# EAGLE design DatatrakEPROMEmu (EAGLE 6.6.0)

## Sheet 1 of 4: Target I/O, level translation and power
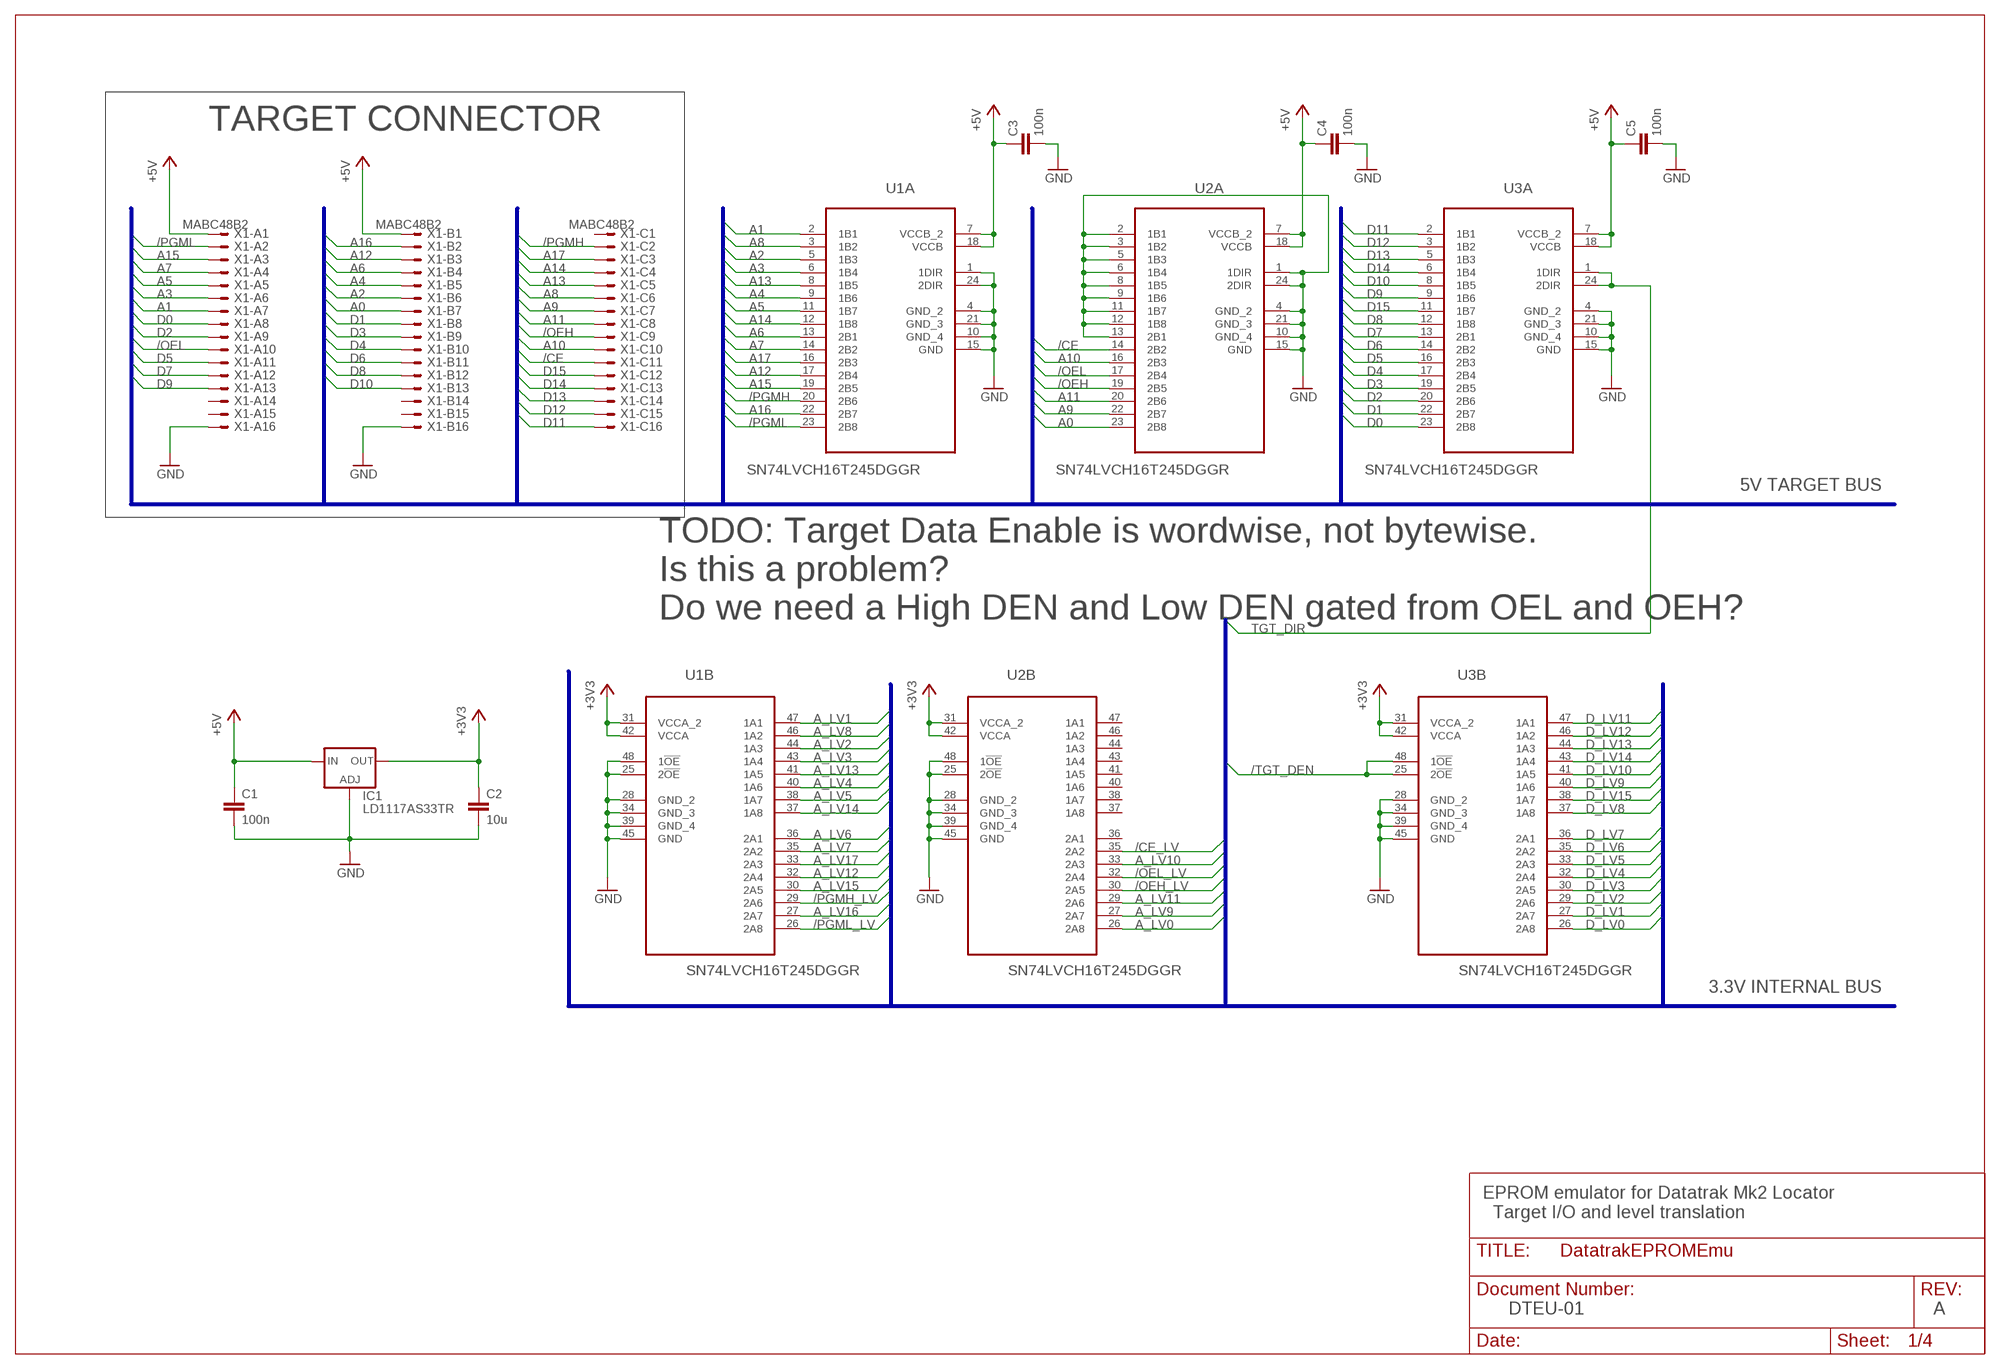
[diagram p0: schematic, sheet 1]

### Parts
C1  100n  C-EUC0805  [C0805]
C2  10u  C-EUC0805  [C0805]
C3  100n  C-EUC0805  [C0805]
C4  100n  C-EUC0805  [C0805]
C5  100n  C-EUC0805  [C0805]
IC1  LD1117AS33TR  LD117AS33TR  [SOT223]
U1  SN74LVCH16T245DGGR  [SOP50P810X120-48N]
U2  SN74LVCH16T245DGGR  [SOP50P810X120-48N]
U3  SN74LVCH16T245DGGR  [SOP50P810X120-48N]
X1  MABC48B2  [MABC48B2]

### Nets
+3V3: C2.1 IC1.4(OUT) U1.31(B:VCCA_2) U1.42(B:VCCA) U2.31(B:VCCA_2) U2.42(B:VCCA) U3.31(B:VCCA_2) U3.42(B:VCCA) ; also sheet 2,3
+5V: C1.1 C3.1 C4.1 C5.1 IC1.3(IN) U1.7(A:VCCB_2) U1.18(A:VCCB) U2.7(A:VCCB_2) U2.18(A:VCCB) U3.7(A:VCCB_2) U3.18(A:VCCB) X1.A1 X1.B1
/CE: U2.14(A:2B2) X1.C11
/CE_LV: U2.35(B:2A2) ; also sheet 3
/OEH: U2.19(A:2B5) X1.C9
/OEH_LV: U2.30(B:2A5) ; also sheet 3
/OEL: U2.17(A:2B4) X1.A10
/OEL_LV: U2.32(B:2A4) ; also sheet 3
/PGMH: U1.20(A:2B6) X1.C2
/PGMH_LV: U1.29(B:2A6) ; also sheet 3
/PGML: U1.23(A:2B8) X1.A2
/PGML_LV: U1.26(B:2A8) ; also sheet 3
/TGT_DEN: U3.25(B:2!OE) U3.48(B:1!OE) ; also sheet 3
A0: U2.23(A:2B8) X1.B7
A1: U1.2(A:1B1) X1.A7
A2: U1.5(A:1B3) X1.B6
A3: U1.6(A:1B4) X1.A6
A4: U1.9(A:1B6) X1.B5
A5: U1.11(A:1B7) X1.A5
A6: U1.13(A:2B1) X1.B4
A7: U1.14(A:2B2) X1.A4
A8: U1.3(A:1B2) X1.C6
A9: U2.22(A:2B7) X1.C7
A10: U2.16(A:2B3) X1.C10
A11: U2.20(A:2B6) X1.C8
A12: U1.17(A:2B4) X1.B3
A13: U1.8(A:1B5) X1.C5
A14: U1.12(A:1B8) X1.C4
A15: U1.19(A:2B5) X1.A3
A16: U1.22(A:2B7) X1.B2
A17: U1.16(A:2B3) X1.C3
A_LV0: U2.26(B:2A8) ; also sheet 3
A_LV1: U1.47(B:1A1) ; also sheet 3
A_LV2: U1.44(B:1A3) ; also sheet 3
A_LV3: U1.43(B:1A4) ; also sheet 3
A_LV4: U1.40(B:1A6) ; also sheet 3
A_LV5: U1.38(B:1A7) ; also sheet 3
A_LV6: U1.36(B:2A1) ; also sheet 3
A_LV7: U1.35(B:2A2) ; also sheet 3
A_LV8: U1.46(B:1A2) ; also sheet 3
A_LV9: U2.27(B:2A7) ; also sheet 3
A_LV10: U2.33(B:2A3) ; also sheet 3
A_LV11: U2.29(B:2A6) ; also sheet 3
A_LV12: U1.32(B:2A4) ; also sheet 3
A_LV13: U1.41(B:1A5) ; also sheet 3
A_LV14: U1.37(B:1A8) ; also sheet 3
A_LV15: U1.30(B:2A5) ; also sheet 3
A_LV16: U1.27(B:2A7) ; also sheet 3
A_LV17: U1.33(B:2A3) ; also sheet 3
D0: U3.23(A:2B8) X1.A8
D1: U3.22(A:2B7) X1.B8
D2: U3.20(A:2B6) X1.A9
D3: U3.19(A:2B5) X1.B9
D4: U3.17(A:2B4) X1.B10
D5: U3.16(A:2B3) X1.A11
D6: U3.14(A:2B2) X1.B11
D7: U3.13(A:2B1) X1.A12
D8: U3.12(A:1B8) X1.B12
D9: U3.9(A:1B6) X1.A13
D10: U3.8(A:1B5) X1.B13
D11: U3.2(A:1B1) X1.C16
D12: U3.3(A:1B2) X1.C15
D13: U3.5(A:1B3) X1.C14
D14: U3.6(A:1B4) X1.C13
D15: U3.11(A:1B7) X1.C12
D_LV0: U3.26(B:2A8) ; also sheet 2,3
D_LV1: U3.27(B:2A7) ; also sheet 2,3
D_LV2: U3.29(B:2A6) ; also sheet 2,3
D_LV3: U3.30(B:2A5) ; also sheet 2,3
D_LV4: U3.32(B:2A4) ; also sheet 2,3
D_LV5: U3.33(B:2A3) ; also sheet 2,3
D_LV6: U3.35(B:2A2) ; also sheet 2,3
D_LV7: U3.36(B:2A1) ; also sheet 2,3
D_LV8: U3.37(B:1A8) ; also sheet 2,3
D_LV9: U3.40(B:1A6) ; also sheet 2,3
D_LV10: U3.41(B:1A5) ; also sheet 2,3
D_LV11: U3.47(B:1A1) ; also sheet 2,3
D_LV12: U3.46(B:1A2) ; also sheet 2,3
D_LV13: U3.44(B:1A3) ; also sheet 2,3
D_LV14: U3.43(B:1A4) ; also sheet 2,3
D_LV15: U3.38(B:1A7) ; also sheet 2,3
GND: C1.2 C2.2 C3.2 C4.2 C5.2 IC1.1(ADJ) U1.1(A:1DIR) U1.4(A:GND_2) U1.10(A:GND_4) U1.15(A:GND) U1.21(A:GND_3) U1.24(A:2DIR) U1.25(B:2!OE) U1.28(B:GND_2) U1.34(B:GND_3) U1.39(B:GND_4) U1.45(B:GND) U1.48(B:1!OE) U2.1(A:1DIR) U2.2(A:1B1) U2.3(A:1B2) U2.4(A:GND_2) U2.5(A:1B3) U2.6(A:1B4) U2.8(A:1B5) U2.9(A:1B6) U2.10(A:GND_4) U2.11(A:1B7) U2.12(A:1B8) U2.13(A:2B1) U2.15(A:GND) U2.21(A:GND_3) U2.24(A:2DIR) U2.25(B:2!OE) U2.28(B:GND_2) U2.34(B:GND_3) U2.39(B:GND_4) U2.45(B:GND) U2.48(B:1!OE) U3.4(A:GND_2) U3.10(A:GND_4) U3.15(A:GND) U3.21(A:GND_3) U3.28(B:GND_2) U3.34(B:GND_3) U3.39(B:GND_4) U3.45(B:GND) X1.A16 X1.B16 ; also sheet 2,3,4
TGT_DIR: U3.1(A:1DIR) U3.24(A:2DIR) ; also sheet 3
Unconnected: U2.36(B:2A1) U2.37(B:1A8) U2.38(B:1A7) U2.40(B:1A6) U2.41(B:1A5) U2.43(B:1A4) U2.44(B:1A3) U2.46(B:1A2) U2.47(B:1A1) X1.A14 X1.A15 X1.B14 X1.B15 X1.C1

### Buses
/PGML,/PGMH,A[0..17],D[0..15],/CE,/OEL,/OEH
/PGML_LV,/PGMH_LV,A_LV[0..17],D_LV[0..15],/CE_LV,/OEL_LV,/OEH_LV,/TGT_DEN,TGT_DIR

### Notes on the sheet
- TARGET CONNECTOR
- 5V TARGET BUS
- TODO: Target Data Enable is wordwise, not bytewise.
  Is this a problem?
  Do we need a High DEN and Low DEN gated from OEL and OEH?
- 3.3V INTERNAL BUS
- EPROM emulator for Datatrak Mk2 Locator
    Target I/O and level translation
- DTEU-01 | A

## Sheet 2 of 4: SRAM
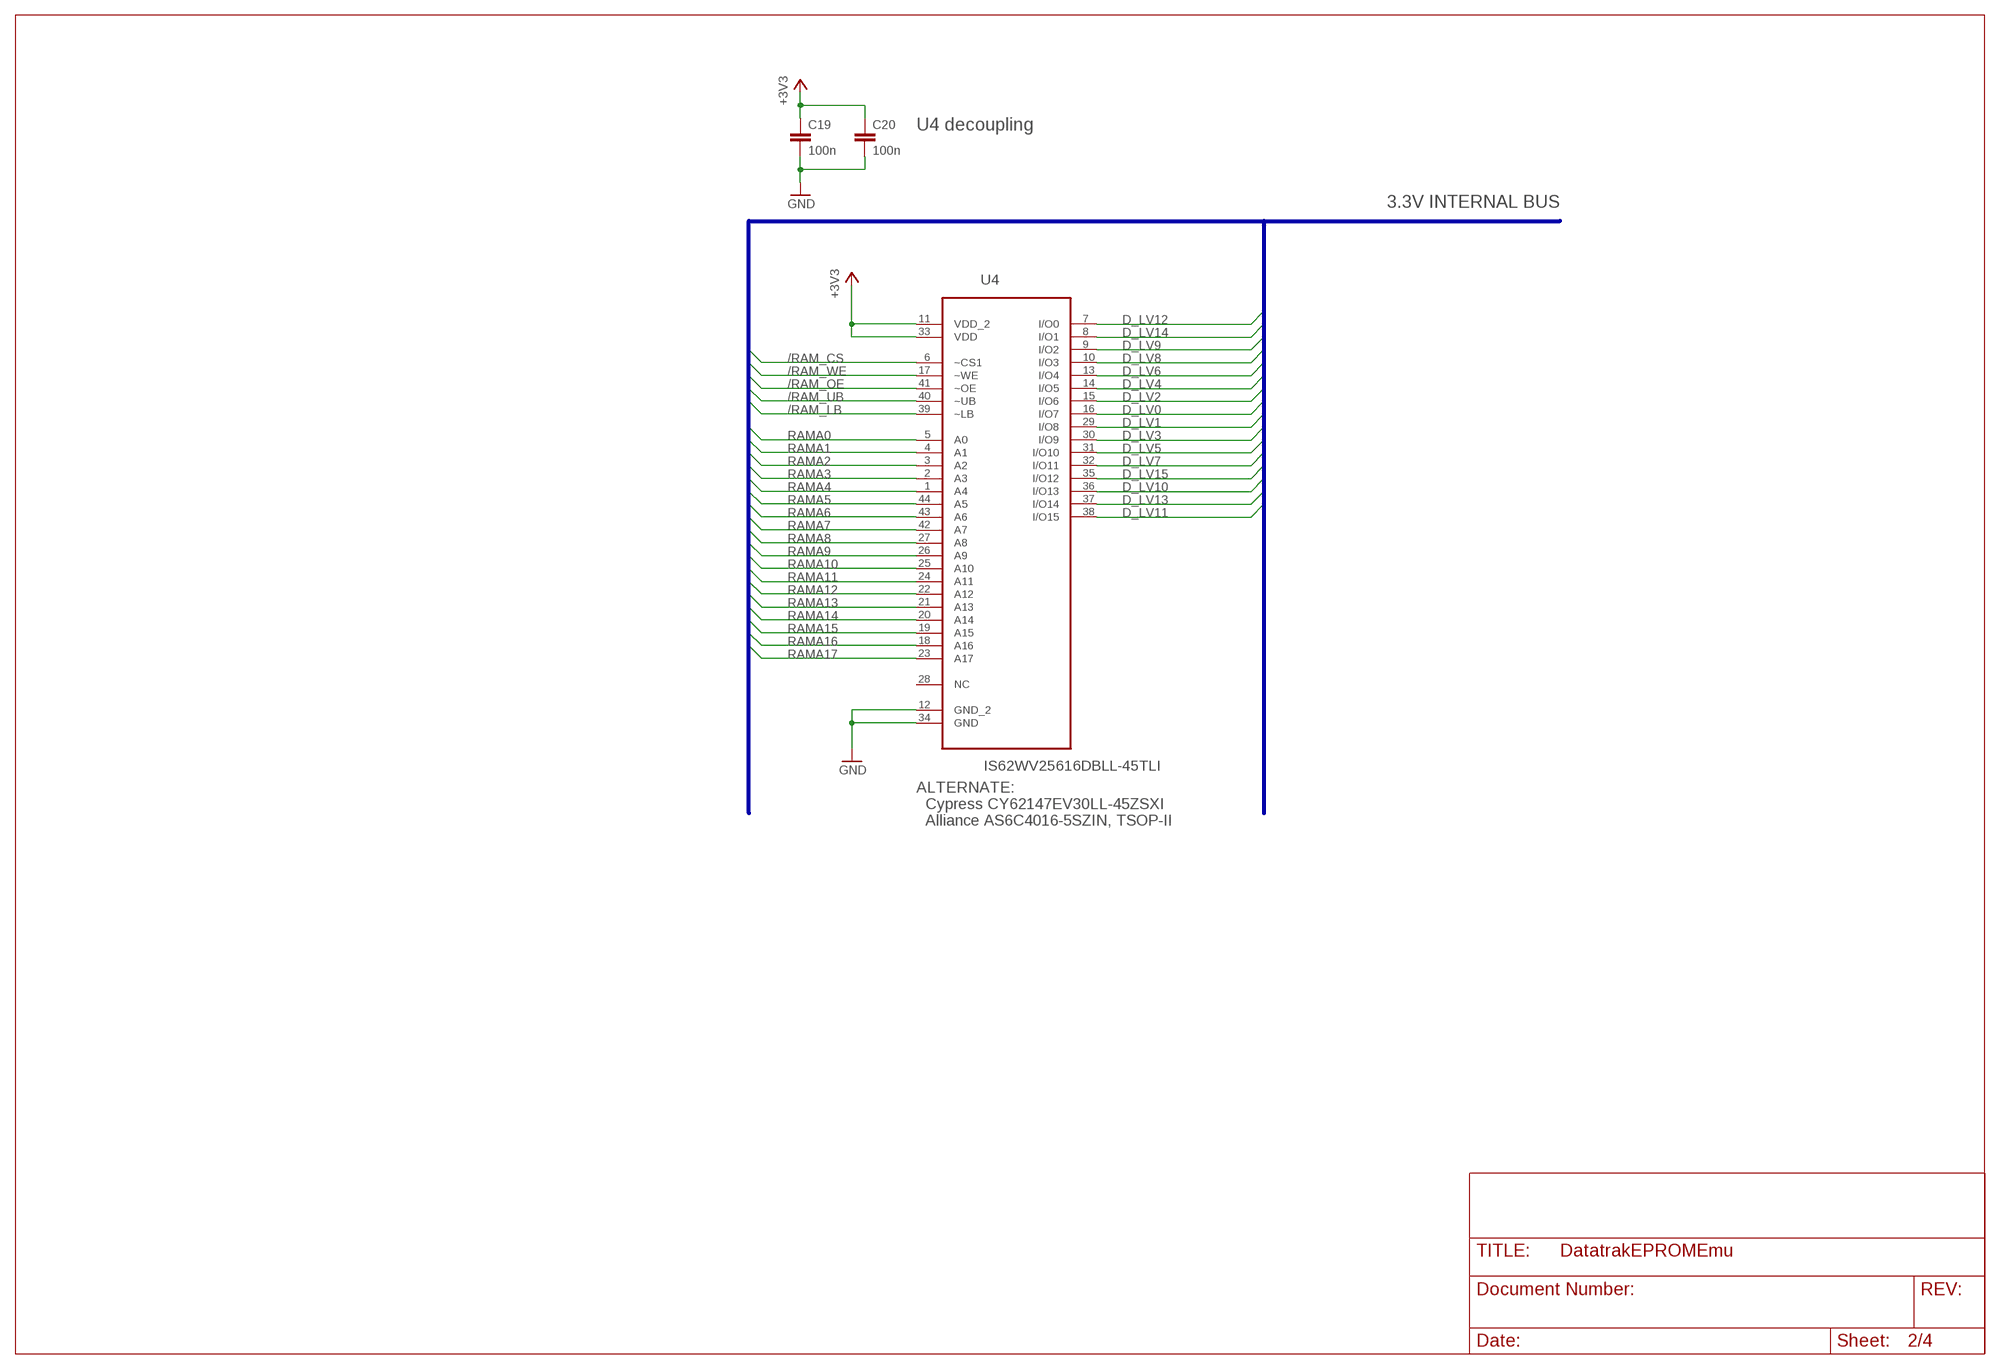
[diagram p1: schematic, sheet 2]

### Parts
C19  100n  C-EUC0805  [C0805]
C20  100n  C-EUC0805  [C0805]
U4  IS62WV25616DBLL-45TLI  [SOP80P1176X120-44N]

### Nets
+3V3: C19.1 C20.1 U4.11(VDD_2) U4.33(VDD) ; also sheet 1,3
/RAM_CS: U4.6(~CS1) ; also sheet 3
/RAM_LB: U4.39(~LB) ; also sheet 3
/RAM_OE: U4.41(~OE) ; also sheet 3
/RAM_UB: U4.40(~UB) ; also sheet 3
/RAM_WE: U4.17(~WE) ; also sheet 3
D_LV0: U4.16(I/O7) ; also sheet 1,3
D_LV1: U4.29(I/O8) ; also sheet 1,3
D_LV2: U4.15(I/O6) ; also sheet 1,3
D_LV3: U4.30(I/O9) ; also sheet 1,3
D_LV4: U4.14(I/O5) ; also sheet 1,3
D_LV5: U4.31(I/O10) ; also sheet 1,3
D_LV6: U4.13(I/O4) ; also sheet 1,3
D_LV7: U4.32(I/O11) ; also sheet 1,3
D_LV8: U4.10(I/O3) ; also sheet 1,3
D_LV9: U4.9(I/O2) ; also sheet 1,3
D_LV10: U4.36(I/O13) ; also sheet 1,3
D_LV11: U4.38(I/O15) ; also sheet 1,3
D_LV12: U4.7(I/O0) ; also sheet 1,3
D_LV13: U4.37(I/O14) ; also sheet 1,3
D_LV14: U4.8(I/O1) ; also sheet 1,3
D_LV15: U4.35(I/O12) ; also sheet 1,3
GND: C19.2 C20.2 U4.12(GND_2) U4.34(GND) ; also sheet 1,3,4
RAMA0: U4.5(A0) ; also sheet 3
RAMA1: U4.4(A1) ; also sheet 3
RAMA2: U4.3(A2) ; also sheet 3
RAMA3: U4.2(A3) ; also sheet 3
RAMA4: U4.1(A4) ; also sheet 3
RAMA5: U4.44(A5) ; also sheet 3
RAMA6: U4.43(A6) ; also sheet 3
RAMA7: U4.42(A7) ; also sheet 3
RAMA8: U4.27(A8) ; also sheet 3
RAMA9: U4.26(A9) ; also sheet 3
RAMA10: U4.25(A10) ; also sheet 3
RAMA11: U4.24(A11) ; also sheet 3
RAMA12: U4.22(A12) ; also sheet 3
RAMA13: U4.21(A13) ; also sheet 3
RAMA14: U4.20(A14) ; also sheet 3
RAMA15: U4.19(A15) ; also sheet 3
RAMA16: U4.18(A16) ; also sheet 3
RAMA17: U4.23(A17) ; also sheet 3
Unconnected: U4.28(NC)

### Buses
/PGML_LV,/PGMH_LV,A_LV[0..17],RAMA[0..17],D_LV[0..15],/CE_LV,/OEL_LV,/OEH_LV,/RAM_CS,/RAM_WE,/RAM_OE,/RAM_UB,/RAM_LB

### Notes on the sheet
- U4 decoupling
- 3.3V INTERNAL BUS
- ALTERNATE:
    Cypress CY62147EV30LL-45ZSXI
    Alliance AS6C4016-5SZIN, TSOP-II

## Sheet 3 of 4: CPLD
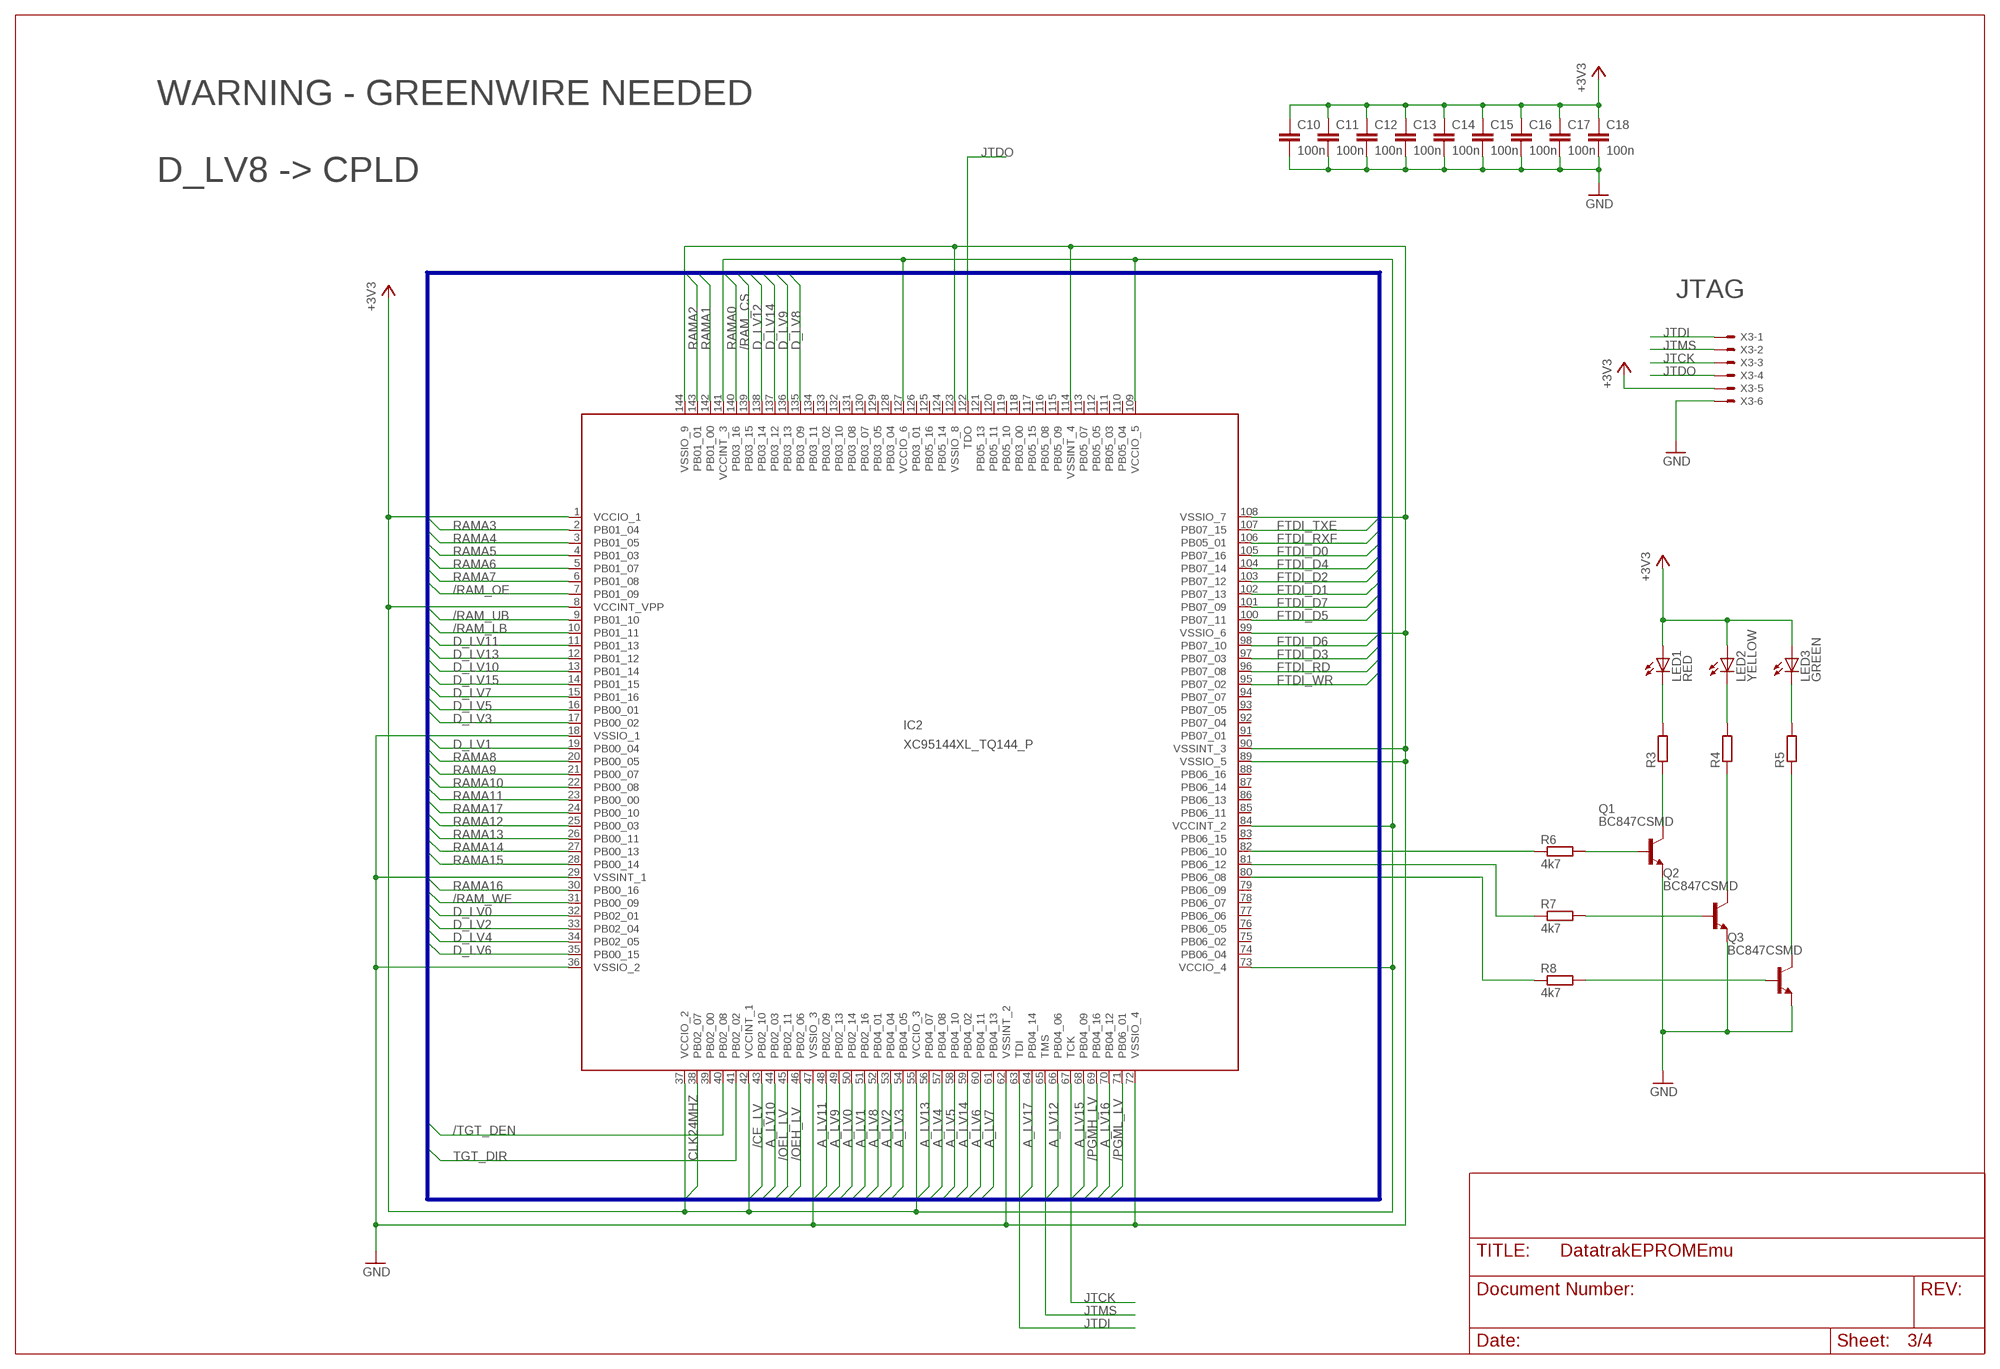
[diagram p2: schematic, sheet 3]

### Parts
C10  100n  C-EUC0805  [C0805]
C11  100n  C-EUC0805  [C0805]
C12  100n  C-EUC0805  [C0805]
C13  100n  C-EUC0805  [C0805]
C14  100n  C-EUC0805  [C0805]
C15  100n  C-EUC0805  [C0805]
C16  100n  C-EUC0805  [C0805]
C17  100n  C-EUC0805  [C0805]
C18  100n  C-EUC0805  [C0805]
IC2  XC95144XL_TQ144_P  [TQ144]
LED1  RED  LEDSML0805  [SML0805]
LED2  YELLOW  LEDSML0805  [SML0805]
LED3  GREEN  LEDSML0805  [SML0805]
Q1  BC847CSMD  [SOT23]
Q2  BC847CSMD  [SOT23]
Q3  BC847CSMD  [SOT23]
R3  R-EU_R0805  [R0805]
R4  R-EU_R0805  [R0805]
R5  R-EU_R0805  [R0805]
R6  4k7  R-EU_R0805  [R0805]
R7  4k7  R-EU_R0805  [R0805]
R8  4k7  R-EU_R0805  [R0805]
X3  22-23-2061  [22-23-2061]

### Nets
+3V3: C10.1 C11.1 C12.1 C13.1 C14.1 C15.1 C16.1 C17.1 C18.1 IC2.1(VCCIO_1) IC2.8(VCCINT_VPP) IC2.37(VCCIO_2) IC2.42(VCCINT_1) IC2.55(VCCIO_3) IC2.73(VCCIO_4) IC2.84(VCCINT_2) IC2.109(VCCIO_5) IC2.127(VCCIO_6) IC2.141(VCCINT_3) LED1.A LED2.A LED3.A X3.5 ; also sheet 1,2
/CE_LV: IC2.43(PB02_10) ; also sheet 1
/OEH_LV: IC2.46(PB02_06) ; also sheet 1
/OEL_LV: IC2.45(PB02_11) ; also sheet 1
/PGMH_LV: IC2.69(PB04_16) ; also sheet 1
/PGML_LV: IC2.71(PB06_01) ; also sheet 1
/RAM_CS: IC2.139(PB03_15) ; also sheet 2
/RAM_LB: IC2.10(PB01_11) ; also sheet 2
/RAM_OE: IC2.7(PB01_09) ; also sheet 2
/RAM_UB: IC2.9(PB01_10) ; also sheet 2
/RAM_WE: IC2.31(PB00_09) ; also sheet 2
/TGT_DEN: IC2.40(PB02_08) ; also sheet 1
A_LV0: IC2.50(PB02_14) ; also sheet 1
A_LV1: IC2.51(PB02_16) ; also sheet 1
A_LV2: IC2.53(PB04_04) ; also sheet 1
A_LV3: IC2.54(PB04_05) ; also sheet 1
A_LV4: IC2.57(PB04_08) ; also sheet 1
A_LV5: IC2.58(PB04_10) ; also sheet 1
A_LV6: IC2.60(PB04_11) ; also sheet 1
A_LV7: IC2.61(PB04_13) ; also sheet 1
A_LV8: IC2.52(PB04_01) ; also sheet 1
A_LV9: IC2.49(PB02_13) ; also sheet 1
A_LV10: IC2.44(PB02_03) ; also sheet 1
A_LV11: IC2.48(PB02_09) ; also sheet 1
A_LV12: IC2.66(PB04_06) ; also sheet 1
A_LV13: IC2.56(PB04_07) ; also sheet 1
A_LV14: IC2.59(PB04_02) ; also sheet 1
A_LV15: IC2.68(PB04_09) ; also sheet 1
A_LV16: IC2.70(PB04_12) ; also sheet 1
A_LV17: IC2.64(PB04_14) ; also sheet 1
CLK24MHZ: IC2.38(PB02_07) ; also sheet 4
D_LV0: IC2.32(PB02_01) ; also sheet 1,2
D_LV1: IC2.19(PB00_04) ; also sheet 1,2
D_LV2: IC2.33(PB02_04) ; also sheet 1,2
D_LV3: IC2.17(PB00_02) ; also sheet 1,2
D_LV4: IC2.34(PB02_05) ; also sheet 1,2
D_LV5: IC2.16(PB00_01) ; also sheet 1,2
D_LV6: IC2.35(PB00_15) ; also sheet 1,2
D_LV7: IC2.15(PB01_16) ; also sheet 1,2
D_LV8: IC2.135(PB03_09) ; also sheet 1,2
D_LV9: IC2.136(PB03_13) ; also sheet 1,2
D_LV10: IC2.13(PB01_14) ; also sheet 1,2
D_LV11: IC2.11(PB01_13) ; also sheet 1,2
D_LV12: IC2.138(PB03_14) ; also sheet 1,2
D_LV13: IC2.12(PB01_12) ; also sheet 1,2
D_LV14: IC2.137(PB03_12) ; also sheet 1,2
D_LV15: IC2.14(PB01_15) ; also sheet 1,2
FTDI_D0: IC2.105(PB07_16) ; also sheet 4
FTDI_D1: IC2.102(PB07_13) ; also sheet 4
FTDI_D2: IC2.103(PB07_12) ; also sheet 4
FTDI_D3: IC2.97(PB07_03) ; also sheet 4
FTDI_D4: IC2.104(PB07_14) ; also sheet 4
FTDI_D5: IC2.100(PB07_11) ; also sheet 4
FTDI_D6: IC2.98(PB07_10) ; also sheet 4
FTDI_D7: IC2.101(PB07_09) ; also sheet 4
FTDI_RD: IC2.96(PB07_08) ; also sheet 4
FTDI_RXF: IC2.106(PB05_01) ; also sheet 4
FTDI_TXE: IC2.107(PB07_15) ; also sheet 4
FTDI_WR: IC2.95(PB07_02) ; also sheet 4
GND: C10.2 C11.2 C12.2 C13.2 C14.2 C15.2 C16.2 C17.2 C18.2 IC2.18(VSSIO_1) IC2.29(VSSINT_1) IC2.36(VSSIO_2) IC2.47(VSSIO_3) IC2.62(VSSINT_2) IC2.72(VSSIO_4) IC2.89(VSSIO_5) IC2.90(VSSINT_3) IC2.99(VSSIO_6) IC2.108(VSSIO_7) IC2.114(VSSINT_4) IC2.123(VSSIO_8) IC2.144(VSSIO_9) Q1.2(E) Q2.2(E) Q3.2(E) X3.6 ; also sheet 1,2,4
JTCK: IC2.67(TCK) X3.3
JTDI: IC2.63(TDI) X3.1
JTDO: IC2.122(TDO) X3.4
JTMS: IC2.65(TMS) X3.2
N$1: Q1.3(C) R3.1
N$9: Q2.3(C) R4.1
N$10: Q3.3(C) R5.1
N$11: LED1.C R3.2
N$12: LED2.C R4.2
N$13: LED3.C R5.2
N$16: IC2.82(PB06_10) R6.1
N$17: IC2.81(PB06_12) R7.1
N$18: IC2.80(PB06_08) R8.1
N$19: Q1.1(B) R6.2
N$20: Q2.1(B) R7.2
N$21: Q3.1(B) R8.2
RAMA0: IC2.140(PB03_16) ; also sheet 2
RAMA1: IC2.142(PB01_00) ; also sheet 2
RAMA2: IC2.143(PB01_01) ; also sheet 2
RAMA3: IC2.2(PB01_04) ; also sheet 2
RAMA4: IC2.3(PB01_05) ; also sheet 2
RAMA5: IC2.4(PB01_03) ; also sheet 2
RAMA6: IC2.5(PB01_07) ; also sheet 2
RAMA7: IC2.6(PB01_08) ; also sheet 2
RAMA8: IC2.20(PB00_05) ; also sheet 2
RAMA9: IC2.21(PB00_07) ; also sheet 2
RAMA10: IC2.22(PB00_08) ; also sheet 2
RAMA11: IC2.23(PB00_00) ; also sheet 2
RAMA12: IC2.25(PB00_03) ; also sheet 2
RAMA13: IC2.26(PB00_11) ; also sheet 2
RAMA14: IC2.27(PB00_13) ; also sheet 2
RAMA15: IC2.28(PB00_14) ; also sheet 2
RAMA16: IC2.30(PB00_16) ; also sheet 2
RAMA17: IC2.24(PB00_10) ; also sheet 2
TGT_DIR: IC2.41(PB02_02) ; also sheet 1
Unconnected: IC2.39(PB02_00) IC2.74(PB06_04) IC2.75(PB06_02) IC2.76(PB06_05) IC2.77(PB06_06) IC2.78(PB06_07) IC2.79(PB06_09) IC2.83(PB06_15) IC2.85(PB06_11) IC2.86(PB06_13) IC2.87(PB06_14) IC2.88(PB06_16) IC2.91(PB07_01) IC2.92(PB07_04) IC2.93(PB07_05) IC2.94(PB07_07) IC2.110(PB05_04) IC2.111(PB05_03) IC2.112(PB05_05) IC2.113(PB05_07) IC2.115(PB05_09) IC2.116(PB05_08) IC2.117(PB05_15) IC2.118(PB03_00) IC2.119(PB05_10) IC2.120(PB05_11) IC2.121(PB05_13) IC2.124(PB05_14) IC2.125(PB05_16) IC2.126(PB03_01) IC2.128(PB03_04) IC2.129(PB03_05) IC2.130(PB03_07) IC2.131(PB03_08) IC2.132(PB03_10) IC2.133(PB03_02) IC2.134(PB03_11)

### Buses
/PGML_LV,/PGMH_LV,A_LV[0..17],RAMA[0..17],D_LV[0..15],/CE_LV,/OEL_LV,/OEH_LV,FTDI_D[0..7],FTDI_RXF,FTDI_TXE,FTDI_RD,FTDI_WR,CLK24MHZ,/RAM_CS,/RAM_WE,/RAM_OE,/RAM_UB,/RAM_LB,/TGT_DEN,TGT_DIR

### Notes on the sheet
- WARNING - GREENWIRE NEEDED
  
  D_LV8 -> CPLD
- JTAG

## Sheet 4 of 4: USB
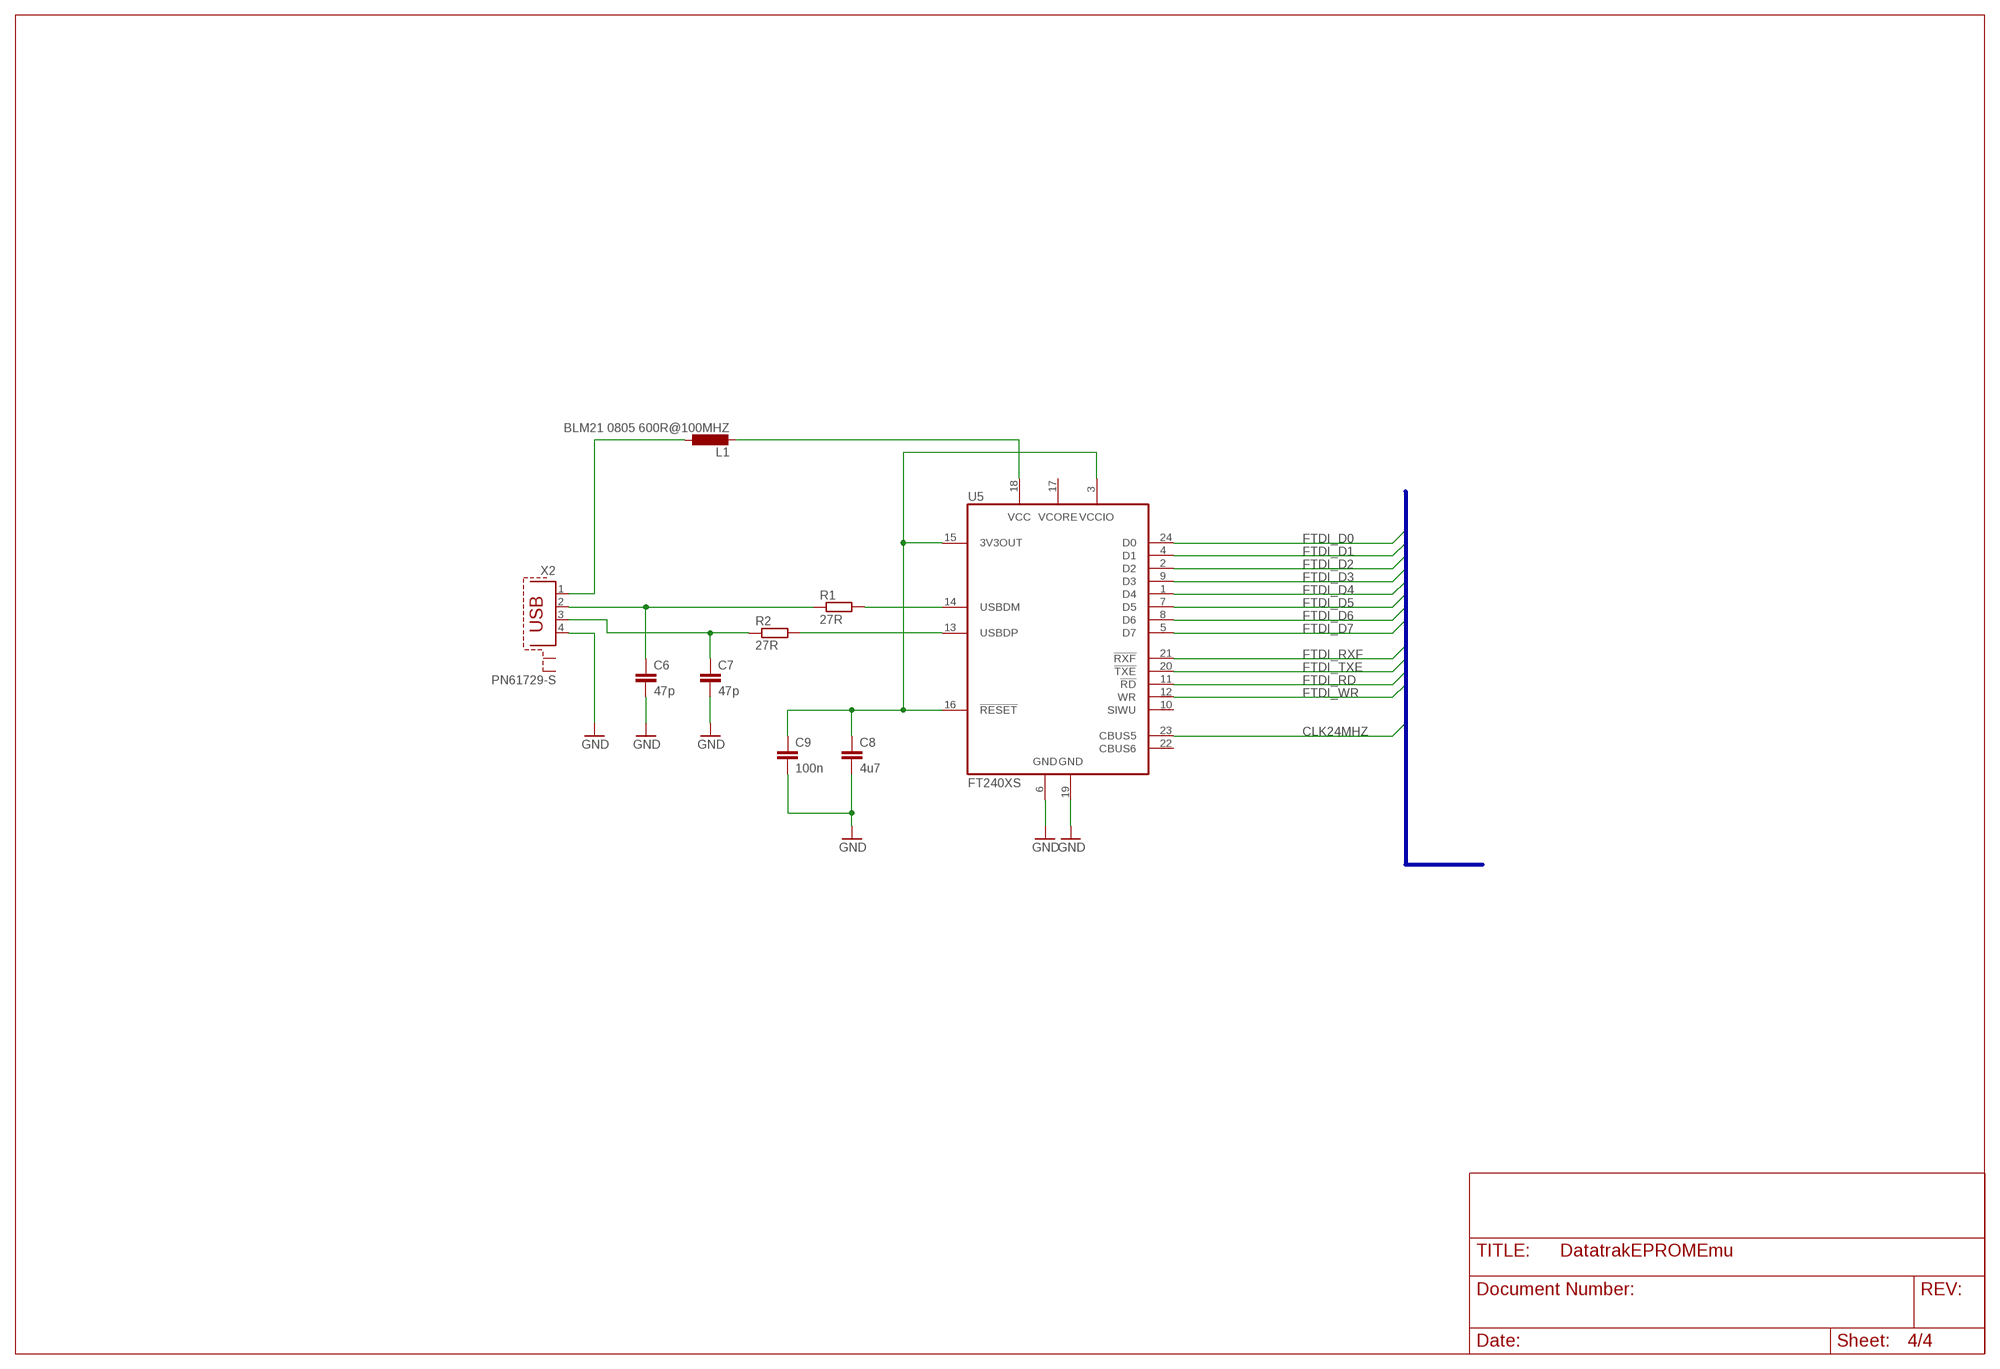
[diagram p3: schematic, sheet 4]

### Parts
C6  47p  C-EUC0805  [C0805]
C7  47p  C-EUC0805  [C0805]
C8  4u7  C-EUC0805  [C0805]
C9  100n  C-EUC0805  [C0805]
L1  BLM21 0805 600R@100MHZ  L-EUL2012C  [L2012C]
R1  27R  R-EU_R0805  [R0805]
R2  27R  R-EU_R0805  [R0805]
U5  FT240XS  [SSOP24]
X2  PN61729-S  [PN61729-S]

### Nets
CLK24MHZ: U5.23(CBUS5) ; also sheet 3
FTDI_D0: U5.24(D0) ; also sheet 3
FTDI_D1: U5.4(D1) ; also sheet 3
FTDI_D2: U5.2(D2) ; also sheet 3
FTDI_D3: U5.9(D3) ; also sheet 3
FTDI_D4: U5.1(D4) ; also sheet 3
FTDI_D5: U5.7(D5) ; also sheet 3
FTDI_D6: U5.8(D6) ; also sheet 3
FTDI_D7: U5.5(D7) ; also sheet 3
FTDI_RD: U5.11(!RD!) ; also sheet 3
FTDI_RXF: U5.21(!RXF!) ; also sheet 3
FTDI_TXE: U5.20(!TXE!) ; also sheet 3
FTDI_WR: U5.12(WR) ; also sheet 3
GND: C6.2 C7.2 C8.2 C9.2 U5.6(GND) U5.19(GND) X2.4 ; also sheet 1,2,3
N$2: L1.2 U5.18(VCC)
N$3: L1.1 X2.1
N$4: R1.2 U5.14(USBDM)
N$5: R2.2 U5.13(USBDP)
N$6: C6.1 R1.1 X2.2
N$7: C7.1 R2.1 X2.3
N$8: C8.1 C9.1 U5.3(VCCIO) U5.15(3V3OUT) U5.16(!RESET!)
Unconnected: U5.10(SIWU) U5.17(VCORE) U5.22(CBUS6) X2.S1 X2.S2

### Buses
FTDI_D[0..7],FTDI_RXF,FTDI_TXE,FTDI_RD,FTDI_WR,CLK24MHZ

## Library data of the parts
C1-C20 = rcl:C-EU: CAPACITOR, European symbol
IC1 = v-reg:LD117A?*: Low drop fixed and adjustable positive voltage regulators 1 A Source: http://www.st.com/stonline/products/literature/ds/7194/ld1117axx.pdf
IC2 = 00_DatatrakEPROMEmu:XC95144XL_TQ144_P: XC95144XL_TQ144 Xilinx XC95144XL CPLD, TQ144 package Symbol pins sorted by pad number. Auto generated by make-symbol-device-package-bsdl.ulp Rev. 44 Source: XC95144XL_TQ144.bsdl
L1 = rcl:L-EU: INDUCTOR, European symbol
LED1-LED3 = led:LED: LED OSRAM: - CHIPLED LG R971, LG N971, LY N971, LG Q971, LY Q971, LO R971, LY R971 LH N974, LH R974 LS Q976, LO Q976, LY Q976 LO Q996 - Hyper CHIPLED LW Q18S LB Q993, LB Q99A, LB R99A - SideLED LS A670, LO A670, LY A670, LG A670, LP A670 LB A673, LV A673, LT A673, LW A673 LH A674 LY A675 LS A676, LA A676, LO A676, LY A676, LW A676 LS A679, LY A679, LG A679 - Hyper Micro SIDELED® LS Y876, LA Y876, LO Y876, LY Y876 LT Y87S - SmartLED LW L88C, LW L88S LB L89C, LB L89S, LG L890 LS L89K, LO L89K, LY L89K LS L896, LA L896, LO L896, LY L896 - TOPLED LS T670, LO T670, LY T670, LG T670, LP T670 LSG T670, LSP T670, LSY T670, LOP T670, LYG T670 LG T671, LOG T671, LSG T671 LB T673, LV T673, LT T673, LW T673 LH T674 LS T676, LA T676, LO T676, LY T676, LB T676, LH T676, LSB T676, LW T676 LB T67C, LV T67C, LT T67C, LS T67K, LO T67K, LY T67K, LW E67C LS E67B, LA E67B, LO E67B, LY E67B, LB E67C, LV E67C, LT E67C LW T67C LS T679, LY T679, LG T679 LS T770, LO T770, LY T770, LG T770, LP T770 LB T773, LV T773, LT T773, LW T773 LH T774 LS E675, LA E675, LY E675, LS T675 LS T776, LA T776, LO T776, LY T776, LB T776 LHGB T686 LT T68C, LB T68C - Hyper Mini TOPLED® LB M676 - Mini TOPLED Santana® LG M470 LS M47K, LO M47K, LY M47K Source: http://www.osram.convergy.de LUXEON: - LUMILED® LXK2-PW12-R00, LXK2-PW12-S00, LXK2-PW14-U00, LXK2-PW14-V00 LXK2-PM12-R00, LXK2-PM12-S00, LXK2-PM14-U00 LXK2-PE12-Q00, LXK2-PE12-R00, LXK2-PE12-S00, LXK2-PE14-T00, LXK2-PE14-U00 LXK2-PB12-K00, LXK2-PB12-L00, LXK2-PB12-M00, LXK2-PB14-N00, LXK2-PB14-P00, LXK2-PB14-Q00 LXK2-PR12-L00, LXK2-PR12-M00, LXK2-PR14-Q00, LXK2-PR14-R00 LXK2-PD12-Q00, LXK2-PD12-R00, LXK2-PD12-S00 LXK2-PH12-R00, LXK2-PH12-S00 LXK2-PL12-P00, LXK2-PL12-Q00, LXK2-PL12-R00 Source: www.luxeon.com KINGBRIGHT: KA-3528ASYC Source: www.kingbright.com
Q1-Q3 = transistor-npn:BC847*: NPN Transistor
R1-R8 = rcl:R-EU_: RESISTOR, European symbol
U1-U3 = 00_DatatrakEPROMEmu:SN74LVCH16T245DGGR: 16-BIT DUAL-SUPPLY BUS TRANSCEIVER,TSSOP-48; MPN: SN74LVCH16T245DGGR; OC_FARNELL: 2308692; OC_NEWARK: 58K6519; PACKAGE: TSSOP-48; SUPPLIER: TEXAS INSTRUMENTS
U4 = 00_DatatrakEPROMEmu:IS62WV25616DBLL-45TLI: STATIC SRAM; MPN: IS62WV25616DBLL-45TLI; OC_FARNELL: 1869970; OC_NEWARK: 32T7410; PACKAGE: TSSOP-44; SUPPLIER: INTEGRATED SILICON SOLUTION (ISSI)
U5 = ftdi-chip:FT240X: USB TO BASIC UART IC
X1 = con-vg:MABC48B2: CONNECTOR male, 48 pins, single, type C/2, rows ABC, grid 2.54 mm
X2 = con-berg:PN61729-S: BERG USB connector; OC_FARNELL: unknown; OC_NEWARK: unknown
X3 = con-molex:22-23-2061: .100" (2.54mm) Center Header - 6 Pin; MF: MOLEX; MPN: 22-23-2061; OC_FARNELL: 1462922; OC_NEWARK: 27C1933

## Board
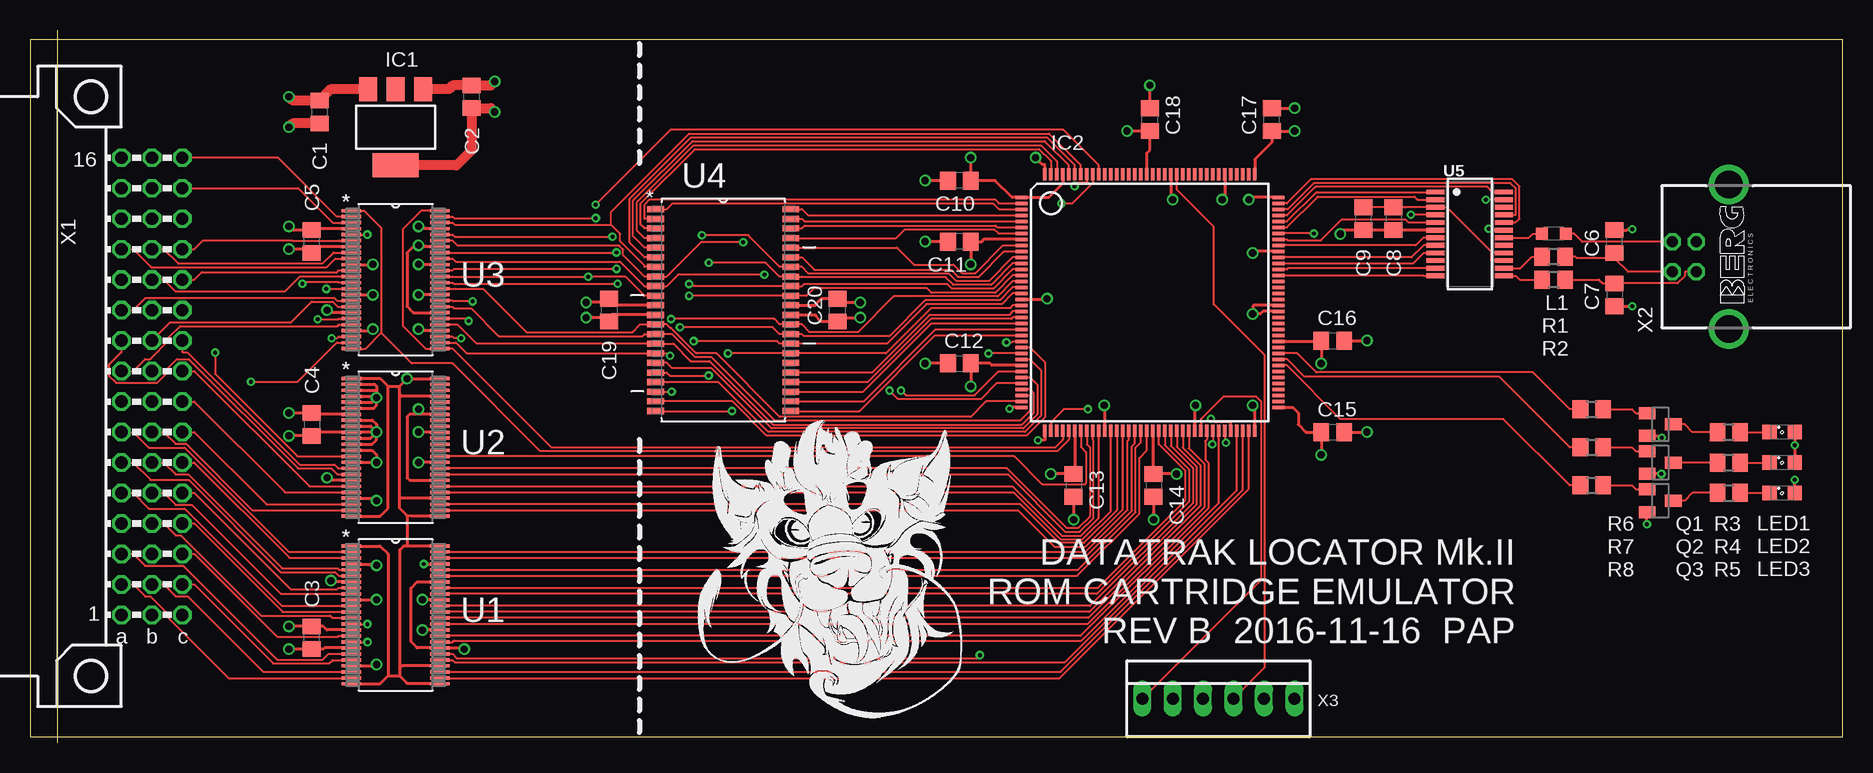
[diagram p4: board, top side]
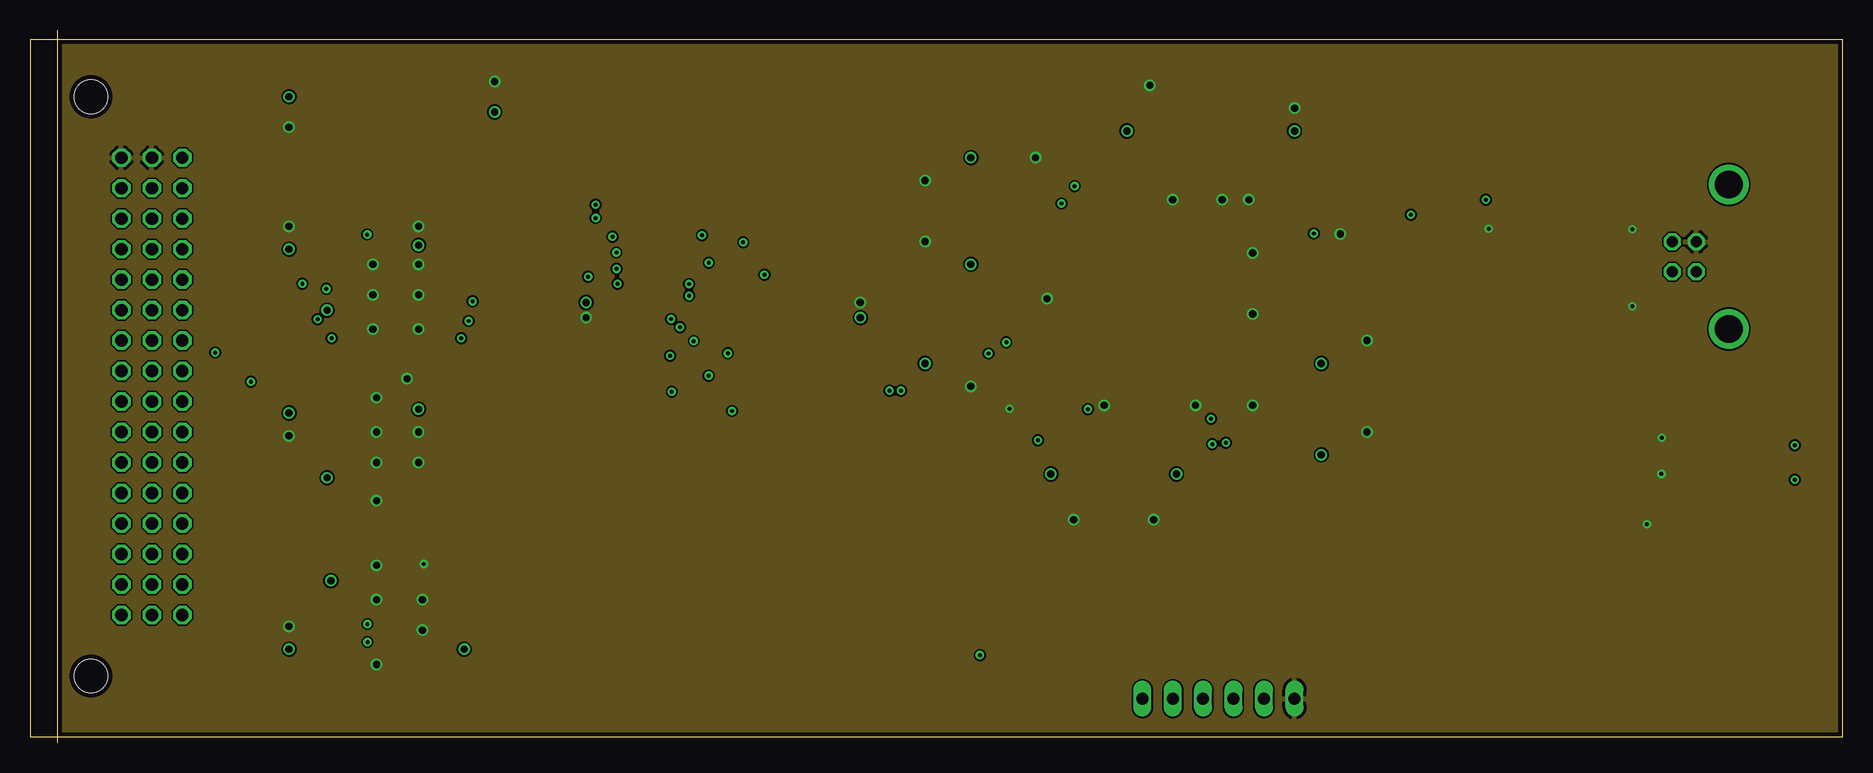
[diagram p5: board, inner layer Route2]
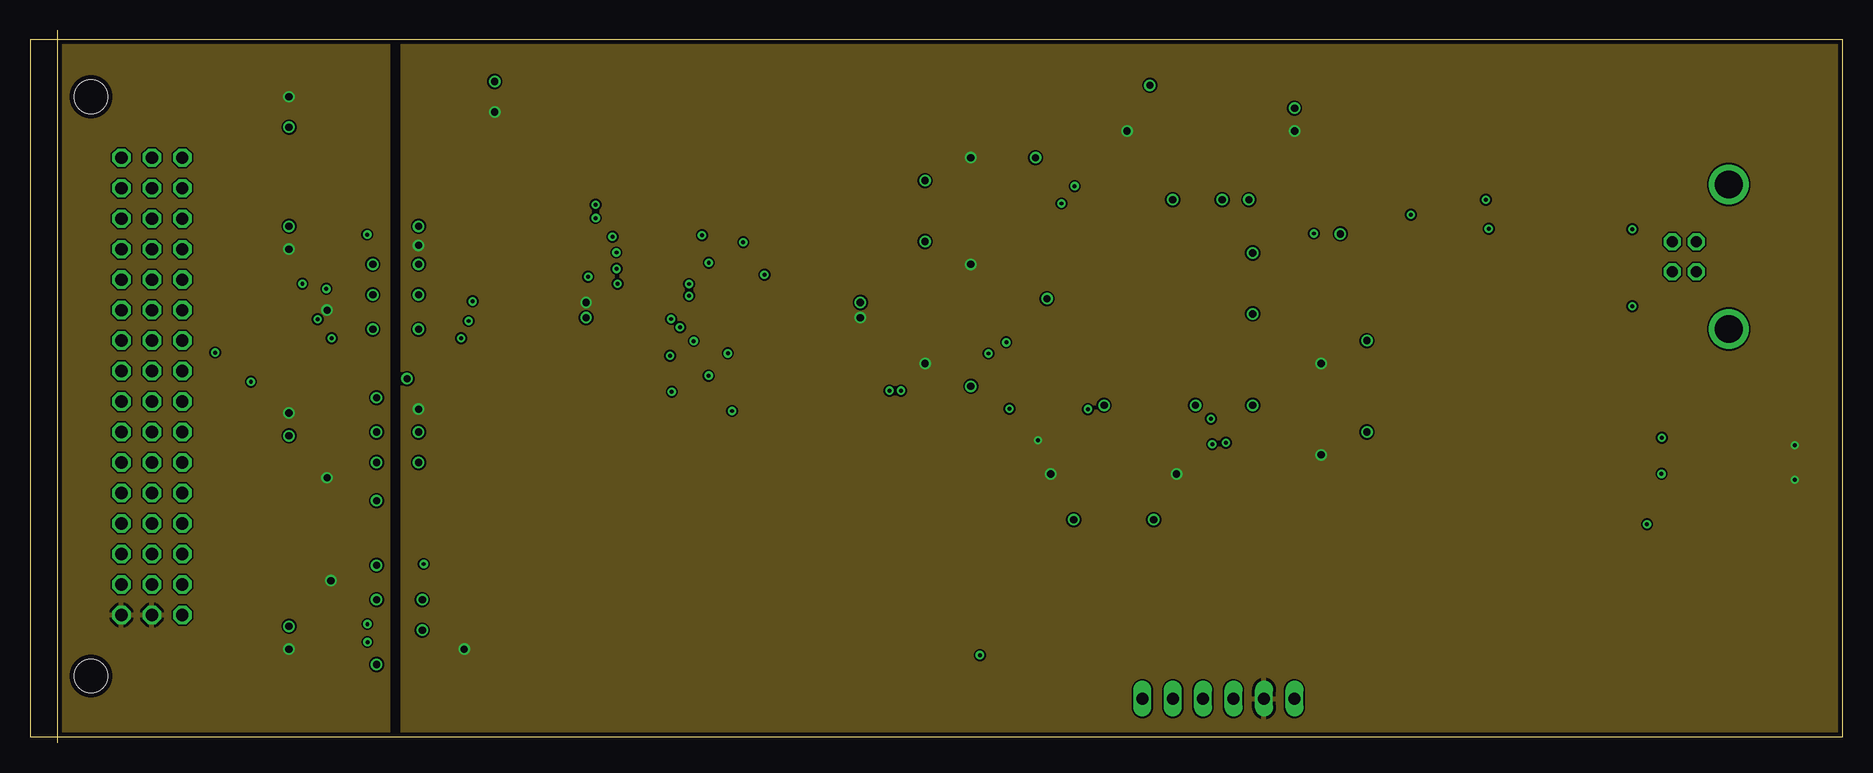
[diagram p6: board, inner layer Route15]
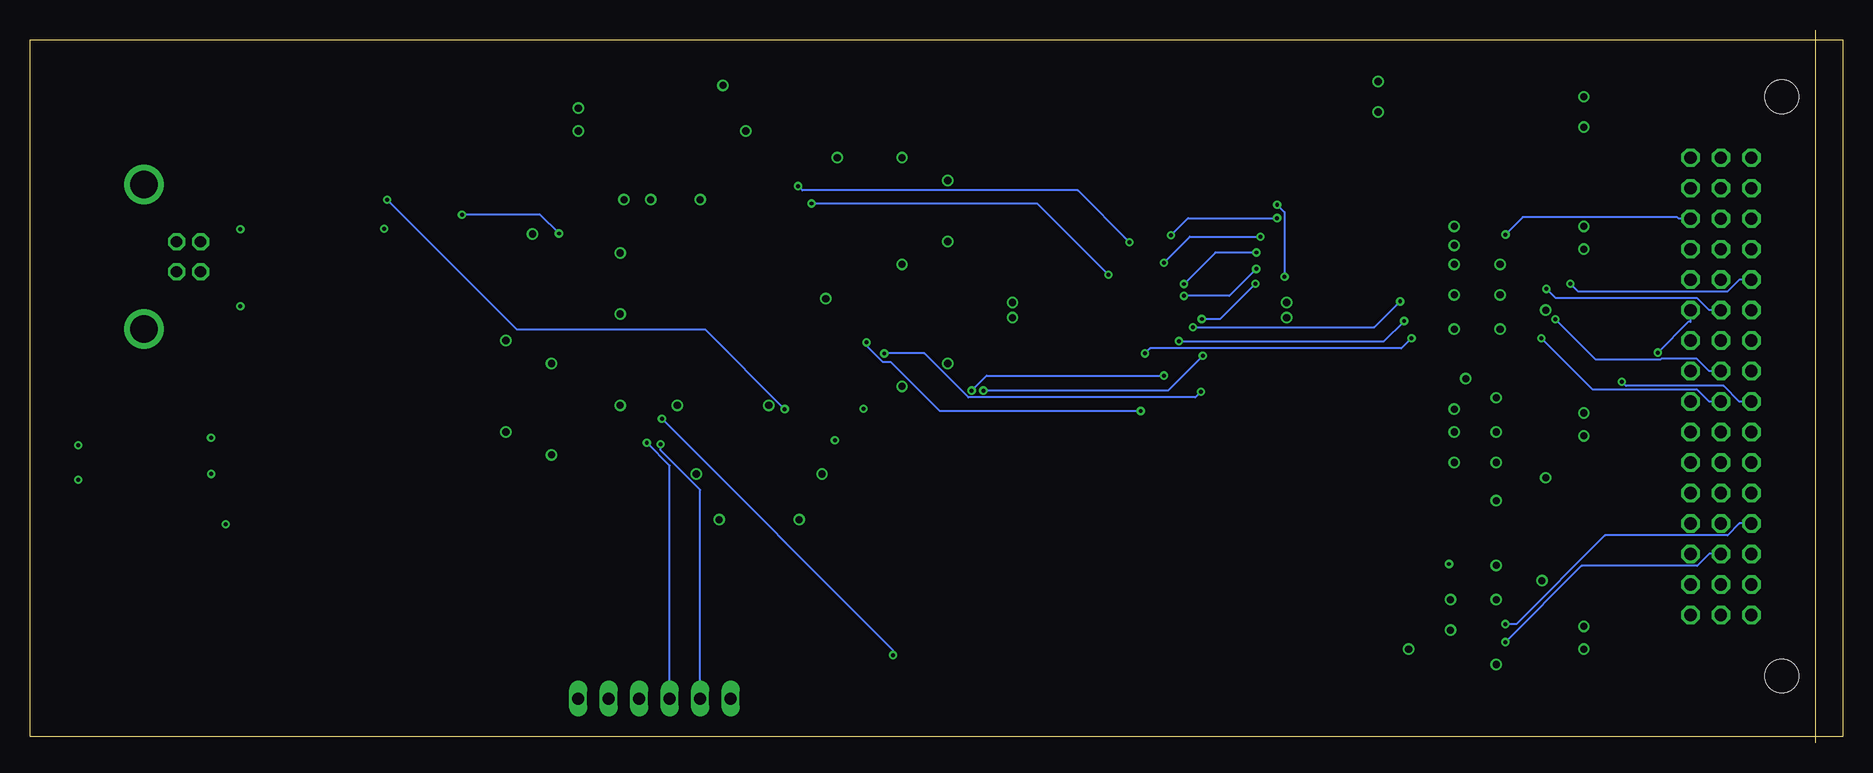
[diagram p7: board, bottom side, seen from below]

Size 151.11 x 58.09 mm. Coordinates in mm from the lower left corner, seen from the top.
Outline: 0,0 151.11,0 151.11,58.09 0,58.09 0,0
Copper layers (1+2*15+16): Top 0.0356mm / dielectric 1.5011mm / Route2 0.0356mm / dielectric 0.1499mm / Route15 0.0356mm / dielectric 0.2007mm / Bottom 0.0356mm
Design rules "LaenPCBOrder *": minimum track width 6mil, minimum drill 13mil, track to track 6mil, track to pad 6mil, pad to pad 6mil, via to via 6mil, smd to smd 6mil, copper to edge 15mil, drill to drill 6mil, minimum pad ring 7mil, minimum via ring 7mil, stop-mask expansion 3mil, vias tented up to drill 0mil, thermal gap 10mil

### Footprints (pad centres in the part's own frame; a part is rotated, then mirrored left to right if it is on the bottom)
C0805 = smd 1.3 x 1.5: 1 -0.95,0; 2 0.95,0
SOT223 = smd 1.5 x 2: 1 -2.3,-3.15; 2 0,-3.15; 3 2.3,-3.15 | smd 3.8 x 2: 4 0,3.15
TQ144 = smd 1 x 0.3: 1 -10.7,8.75; 2 -10.7,8.25; 3 -10.7,7.75; 4 -10.7,7.25; 5 -10.7,6.75; 6 -10.7,6.25; 7 -10.7,5.75; 8 -10.7,5.25; 9 -10.7,4.75; 10 -10.7,4.25; 11 -10.7,3.75; 12 -10.7,3.25; 13 -10.7,2.75; 14 -10.7,2.25; 15 -10.7,1.75; 16 -10.7,1.25; 17 -10.7,0.75; 18 -10.7,0.25; 19 -10.7,-0.25; 20 -10.7,-0.75; 21 -10.7,-1.25; 22 -10.7,-1.75; 23 -10.7,-2.25; 24 -10.7,-2.75; 25 -10.7,-3.25; 26 -10.7,-3.75; 27 -10.7,-4.25; 28 -10.7,-4.75; 29 -10.7,-5.25; 30 -10.7,-5.75; 31 -10.7,-6.25; 32 -10.7,-6.75; 33 -10.7,-7.25; 34 -10.7,-7.75; 35 -10.7,-8.25; 36 -10.7,-8.75; 73 10.7,-8.75; 74 10.7,-8.25; 75 10.7,-7.75; 76 10.7,-7.25; 77 10.7,-6.75; 78 10.7,-6.25; 79 10.7,-5.75; 80 10.7,-5.25; 81 10.7,-4.75; 82 10.7,-4.25; 83 10.7,-3.75; 84 10.7,-3.25; 85 10.7,-2.75; 86 10.7,-2.25; 87 10.7,-1.75; 88 10.7,-1.25; 89 10.7,-0.75; 90 10.7,-0.25; 91 10.7,0.25; 92 10.7,0.75; 93 10.7,1.25; 94 10.7,1.75; 95 10.7,2.25; 96 10.7,2.75; 97 10.7,3.25; 98 10.7,3.75; 99 10.7,4.25; 100 10.7,4.75; 101 10.7,5.25; 102 10.7,5.75; 103 10.7,6.25; 104 10.7,6.75; 105 10.7,7.25; 106 10.7,7.75; 107 10.7,8.25; 108 10.7,8.75 | smd 0.3 x 1: 37 -8.75,-10.7; 38 -8.25,-10.7; 39 -7.75,-10.7; 40 -7.25,-10.7; 41 -6.75,-10.7; 42 -6.25,-10.7; 43 -5.75,-10.7; 44 -5.25,-10.7; 45 -4.75,-10.7; 46 -4.25,-10.7; 47 -3.75,-10.7; 48 -3.25,-10.7; 49 -2.75,-10.7; 50 -2.25,-10.7; 51 -1.75,-10.7; 52 -1.25,-10.7; 53 -0.75,-10.7; 54 -0.25,-10.7; 55 0.25,-10.7; 56 0.75,-10.7; 57 1.25,-10.7; 58 1.75,-10.7; 59 2.25,-10.7; 60 2.75,-10.7; 61 3.25,-10.7; 62 3.75,-10.7; 63 4.25,-10.7; 64 4.75,-10.7; 65 5.25,-10.7; 66 5.75,-10.7; 67 6.25,-10.7; 68 6.75,-10.7; 69 7.25,-10.7; 70 7.75,-10.7; 71 8.25,-10.7; 72 8.75,-10.7; 109 8.75,10.7; 110 8.25,10.7; 111 7.75,10.7; 112 7.25,10.7; 113 6.75,10.7; 114 6.25,10.7; 115 5.75,10.7; 116 5.25,10.7; 117 4.75,10.7; 118 4.25,10.7; 119 3.75,10.7; 120 3.25,10.7; 121 2.75,10.7; 122 2.25,10.7; 123 1.75,10.7; 124 1.25,10.7; 125 0.75,10.7; 126 0.25,10.7; 127 -0.25,10.7; 128 -0.75,10.7; 129 -1.25,10.7; 130 -1.75,10.7; 131 -2.25,10.7; 132 -2.75,10.7; 133 -3.25,10.7; 134 -3.75,10.7; 135 -4.25,10.7; 136 -4.75,10.7; 137 -5.25,10.7; 138 -5.75,10.7; 139 -6.25,10.7; 140 -6.75,10.7; 141 -7.25,10.7; 142 -7.75,10.7; 143 -8.25,10.7; 144 -8.75,10.7
L2012C = smd 1 x 1: 1 -1,0; 2 1,0
SML0805 = smd 1.2 x 1.2: A 1.05,0; C -1.05,0
SOT23 = smd 1 x 1.4: 1 -0.95,-1.1; 2 0.95,-1.1; 3 0,1.1
R0805 = smd 1.3 x 1.5: 1 -0.95,0; 2 0.95,0
SOP50P810X120-48N = smd 1.651 x 0.279: 1 -3.683,5.74; 2 -3.683,5.258; 3 -3.683,4.75; 4 -3.683,4.242; 5 -3.683,3.759; 6 -3.683,3.251; 7 -3.683,2.743; 8 -3.683,2.261; 9 -3.683,1.753; 10 -3.683,1.245; 11 -3.683,0.762; 12 -3.683,0.254; 13 -3.683,-0.254; 14 -3.683,-0.762; 15 -3.683,-1.245; 16 -3.683,-1.753; 17 -3.683,-2.261; 18 -3.683,-2.743; 19 -3.683,-3.251; 20 -3.683,-3.759; 21 -3.683,-4.242; 22 -3.683,-4.75; 23 -3.683,-5.258; 24 -3.683,-5.74; 25 3.683,-5.74; 26 3.683,-5.258; 27 3.683,-4.75; 28 3.683,-4.242; 29 3.683,-3.759; 30 3.683,-3.251; 31 3.683,-2.743; 32 3.683,-2.261; 33 3.683,-1.753; 34 3.683,-1.245; 35 3.683,-0.762; 36 3.683,-0.254; 37 3.683,0.254; 38 3.683,0.762; 39 3.683,1.245; 40 3.683,1.753; 41 3.683,2.261; 42 3.683,2.743; 43 3.683,3.251; 44 3.683,3.759; 45 3.683,4.242; 46 3.683,4.75; 47 3.683,5.258; 48 3.683,5.74
SOP80P1176X120-44N = smd 1.397 x 0.508: 1 -5.639,8.407; 2 -5.639,7.595; 3 -5.639,6.807; 4 -5.639,5.994; 5 -5.639,5.207; 6 -5.639,4.394; 7 -5.639,3.607; 8 -5.639,2.794; 9 -5.639,2.007; 10 -5.639,1.194; 11 -5.639,0.406; 12 -5.639,-0.406; 13 -5.639,-1.194; 14 -5.639,-2.007; 15 -5.639,-2.794; 16 -5.639,-3.607; 17 -5.639,-4.394; 18 -5.639,-5.207; 19 -5.639,-5.994; 20 -5.639,-6.807; 21 -5.639,-7.595; 22 -5.639,-8.407; 23 5.639,-8.407; 24 5.639,-7.595; 25 5.639,-6.807; 26 5.639,-5.994; 27 5.639,-5.207; 28 5.639,-4.394; 29 5.639,-3.607; 30 5.639,-2.794; 31 5.639,-2.007; 32 5.639,-1.194; 33 5.639,-0.406; 34 5.639,0.406; 35 5.639,1.194; 36 5.639,2.007; 37 5.639,2.794; 38 5.639,3.607; 39 5.639,4.394; 40 5.639,5.207; 41 5.639,5.994; 42 5.639,6.807; 43 5.639,7.595; 44 5.639,8.407
SSOP24 = smd 0.4 x 1.5: 1 -3.493,-2.857; 2 -2.857,-2.857; 3 -2.223,-2.857; 4 -1.587,-2.857; 5 -0.953,-2.857; 6 -0.318,-2.857; 7 0.318,-2.857; 8 0.953,-2.857; 9 1.587,-2.857; 10 2.223,-2.857; 11 2.857,-2.857; 12 3.493,-2.857; 13 3.493,2.857; 14 2.857,2.857; 15 2.223,2.857; 16 1.587,2.857; 17 0.953,2.857; 18 0.318,2.857; 19 -0.318,2.857; 20 -0.953,2.857; 21 -1.587,2.857; 22 -2.223,2.857; 23 -2.857,2.857; 24 -3.493,2.857
MABC48B2 = drill 1.016 octagon: A1 -2.54,19.05; A2 -2.54,16.51; A3 -2.54,13.97; A4 -2.54,11.43; A5 -2.54,8.89; A6 -2.54,6.35; A7 -2.54,3.81; A8 -2.54,1.27; A9 -2.54,-1.27; A10 -2.54,-3.81; A11 -2.54,-6.35; A12 -2.54,-8.89; A13 -2.54,-11.43; A14 -2.54,-13.97; A15 -2.54,-16.51; A16 -2.54,-19.05; B1 -5.08,19.05; B2 -5.08,16.51; B3 -5.08,13.97; B4 -5.08,11.43; B5 -5.08,8.89; B6 -5.08,6.35; B7 -5.08,3.81; B8 -5.08,1.27; B9 -5.08,-1.27; B10 -5.08,-3.81; B11 -5.08,-6.35; B12 -5.08,-8.89; B13 -5.08,-11.43; B14 -5.08,-13.97; B15 -5.08,-16.51; B16 -5.08,-19.05; C1 -7.62,19.05; C2 -7.62,16.51; C3 -7.62,13.97; C4 -7.62,11.43; C5 -7.62,8.89; C6 -7.62,6.35; C7 -7.62,3.81; C8 -7.62,1.27; C9 -7.62,-1.27; C10 -7.62,-3.81; C11 -7.62,-6.35; C12 -7.62,-8.89; C13 -7.62,-11.43; C14 -7.62,-13.97; C15 -7.62,-16.51; C16 -7.62,-19.05 | hole 2.794: 0,24.13; 0,-24.13
PN61729-S = drill 0.95 octagon: 1 1.25,4.71; 2 -1.25,4.71; 3 -1.25,2.71; 4 1.25,2.71 | drill 2.3 pad 2.9: S1 -6.02,0; S2 6.02,0
22-23-2061 = drill 1 long: 1 -6.35,0; 2 -3.81,0; 3 -1.27,0; 4 1.27,0; 5 3.81,0; 6 6.35,0

### Placement (x,y rotation side)
C1  24.13,52.07 270 top
C2  36.83,53.34 90 top
C3  23.5,8.26 90 top
C4  23.5,26.04 270 top
C5  23.5,41.27 90 top
C6  132.08,41.27 90 top
C7  132.08,36.83 270 top
C8  113.67,43.18 270 top
C9  111.12,43.18 270 top
C10  77.47,46.35 180 top
C11  77.47,41.27 180 top
C12  77.47,31.11 0 top
C13  87,20.95 270 top
C14  93.66,20.95 270 top
C15  108.58,25.4 0 top
C16  108.58,33.02 0 top
C17  103.5,51.44 90 top
C18  93.34,51.44 90 top
C19  48.26,35.56 270 top
C20  67.31,35.56 90 top
IC1  30.48,50.8 180 top
IC2  93.34,36.2 0 top
L1  127,41.91 180 top
LED1  146.05,25.4 0 top
LED2  146.05,22.86 0 top
LED3  146.05,20.32 0 top
Q1  135.89,26.04 270 top
Q2  135.89,22.86 270 top
Q3  135.89,19.68 270 top
R1  127,40.01 180 top
R2  127,38.1 180 top
R3  141.6,25.4 0 top
R4  141.6,22.86 0 top
R5  141.6,20.32 0 top
R6  130.18,27.3 0 top
R7  130.18,24.13 0 top
R8  130.18,20.95 0 top
U1  30.48,10.16 0 top
U2  30.48,24.13 0 top
U3  30.48,38.1 0 top
U4  57.78,35.56 0 top
U5  120.02,41.91 270 top
U$1  [CHAOSLOGO]  66.67,13.97 0 top
X1  5.08,29.21 180 top
X2  141.6,40.01 90 top
X3  99.06,3.17 0 top

### Tracks (layer width: path | path; a pad name or v marks a point on that pad's centre or on a via)
+3V3  (via drill 0.33 pad 0.69, 0.6 pad 0.96)
  Top 0.254: IC2.141 86.09,46.12 84.92,44.95 IC2.1 81.86,44.95 80.46,46.35 C10.1 v78.42,48.26 | IC2.37 84.59,24.71 v84.02,24.71 | LED2.A v147.1,24.3 LED1.A | LED3.A v147.1,21.42 | 32.5,40.84 31.95,40.84 31.43,40.32 31.43,35.88 31.95,35.36 U3.31 | v32.38,27.3 32.38,26.87 | 32.38,26.87 31.64,26.87 31.43,26.67 31.43,21.59 31.64,21.39 U2.31 | U2.42 32.38,26.87 | 32.5,40.84 v32.38,40.96 | U3.42 32.5,40.84 | v36.2,7.3 36.08,7.42 U1.31 32.27,7.42 31.75,7.94 31.75,12.38 32.27,12.9 U1.42 | 65.41,35.15 65.95,34.61 C20.1 67.31,34.92 v69.22,34.92 | 93.59,21.97 C14.1 | IC2.55 93.59,21.97 | IC2.42 87.09,22 C13.1 v85.09,21.91 | 93.59,21.97 95.5,21.97 v95.57,21.91 | IC2.73 105.27,27.45 105.73,26.99 105.73,26.04 106.36,25.4 C15.1 v107.64,23.5 v107.63,23.5 | IC2.109 102.09,48.12 103.5,49.53 C17.1 v105.41,50.48 | IC2.84 107.56,32.95 C16.1 107.64,31.43 v107.63,31.11 | IC2.127 93.09,48.65 93.34,48.9 C18.1 v91.44,50.48 | C12.1 v74.61,31.11 | IC2.8 79.52,41.45 79.35,41.27 C11.1 78.42,40.01 v78.42,39.37 | U4.11 48.49,35.97 48.26,36.2 | 48.26,36.2 v46.35,36.2 | C19.1 48.26,36.2 | 65.41,35.15 65.5,35.15 | U4.33 65.41,35.15
  Top 0.813: IC1.4 30.5,47.62 35.56,47.62 36.83,48.9 C2.1 38.41,52.39 v38.73,52.07
  pour Route15: 31.11,0 31.11,58.42 151.13,58.42 151.13,0
+5V  (via drill 0.6 pad 0.96)
  Top 0.254: U1.7 25.2,12.9 v25.08,13.02 | U3.18 24.97,35.36 v24.77,35.56 | U2.18 24.97,21.39 v24.77,21.59 | U2.7 23.61,26.87 C4.1 v21.59,26.98 v21.59,26.99 | U1.18 24.56,7.42 24.45,7.3 C3.1 v21.59,7.3 | 24.01,40.84 24.01,40.76 24.13,40.64 v21.59,40.64 | 24.01,40.84 C5.1 | U3.7 24.01,40.84
  Top 0.813: v21.59,53.34 21.91,53.02 C1.1 25.06,53.95 IC1.3
  pour Route15: 0,58.42 0,0 29.84,0 29.84,58.42
/CE  (via drill 0.33 pad 0.69)
  Top 0.152: v15.43,32.02 15.43,30.24 22.3,23.37 U2.14
  Bottom 0.152: X1.C11 12.7,34.57 12.88,34.57 v15.43,32.02
/CE_LV
  Top 0.152: IC2.43 87.59,24.16 88.03,23.73 88.03,21.16 87.89,21.03 84.4,21.03 82.05,23.37 U2.35
/OEH
  Top 0.152: X1.C9 13.69,30.48 23.29,20.88 U2.19
/OEH_LV
  Top 0.152: U2.30 81.91,20.88 86.01,16.77 87.62,16.77 89.09,18.25 IC2.46
/OEL
  Top 0.152: X1.A10 7.62,32.03 6.58,30.99 6.58,30.09 7.18,29.49 10.59,29.49 11.43,30.33 11.43,30.66 12.24,31.47 13.25,31.47 22.34,22.38 25.1,22.38 25.61,21.87 U2.17
/OEL_LV
  Top 0.152: U2.32 81.5,21.87 86.29,17.08 87.49,17.08 88.64,18.23 88.64,24.72 88.59,24.77 IC2.45
/PGMH
  Top 0.152: X1.C2 13.69,12.7 20.27,6.12 24.95,6.12 25.23,6.4 U1.20
/PGMH_LV
  Top 0.152: U1.29 35.22,6.4 35.39,6.23 86.28,6.23 100.59,20.54 IC2.69
/PGML
  Top 0.152: X1.A2 8.61,12.7 9.6,11.71 10.03,11.71 11.43,10.31 11.43,10.02 16.55,4.9 U1.23
/PGML_LV
  Top 0.152: U1.26 85.83,4.9 101.59,20.67 IC2.71
/RAM_CS
  Top 0.152: IC2.139 87.09,47.62 84.77,49.95 55.1,49.95 49.98,44.83 49.98,41.19 51.22,39.95 U4.6
/RAM_LB
  Top 0.152: U4.39 64.35,39.95 65.39,38.91 76.75,38.91 77.34,38.33 79.09,38.33 81.2,40.45 IC2.10
/RAM_OE
  Top 0.152: U4.41 72.2,41.55 72.94,42.29 80.37,42.29 80.71,41.95 IC2.7
/RAM_UB
  Top 0.152: U4.40 72.28,40.77 73.69,39.36 76.96,39.36 77.69,38.63 78.8,38.63 81.11,40.95 IC2.9
/RAM_WE
  Top 0.152: IC2.31 83.37,29.95 83.98,29.34 83.98,26.88 82.81,25.71 61.81,25.71 56.8,30.72 53.52,30.72 53.07,31.17 U4.17
/TGT_DEN
  Top 0.152: U3.48 32.62,43.84 31.07,42.29 31.07,34.27 32.98,32.36 U3.25 35.22,32.36 43.47,24.11 85.44,24.11 86.09,24.77 IC2.40
A0
  Top 0.152: X1.B7 11.15,25.4 12.14,24.41 13,24.41 18.54,18.87 U2.23
A1
  Top 0.152: X1.A7 8.61,25.4 9.91,24.1 12.89,24.1 21.57,15.42 U1.2
A2
  Top 0.152: X1.B6 11.15,22.86 12.14,21.87 13.18,21.87 21.02,14.03 25.63,14.03 25.74,13.92 U1.5
A3
  Top 0.152: X1.A6 8.61,22.86 10.06,21.41 13.21,21.41 20.89,13.73 25.43,13.73 25.74,13.41 U1.6
A4
  Top 0.152: X1.B5 11.15,20.32 12.14,19.33 13.49,19.33 20.91,11.91 U1.9
A5
  Top 0.152: X1.A5 8.61,20.32 9.91,19.02 12.89,19.02 20.98,10.92 U1.11
A6
  Top 0.152: X1.B4 11.15,17.78 12.14,16.79 12.57,16.79 19.26,10.1 25.02,10.1 25.21,9.91 U1.13
A7  (via drill 0.33 pad 0.69)
  Top 0.152: U1.14 v28.12,9.4
  Bottom 0.152: X1.A4 8.61,17.78 9.6,16.79 19.83,16.79 27.22,9.4 v28.12,9.4
A8
  Top 0.152: X1.C6 13.69,22.86 21.64,14.91 U1.3
A9
  Top 0.152: X1.C7 13.69,25.4 19.71,19.38 U2.22
A10
  Top 0.152: X1.C10 12.7,32.03 13.12,32.03 22.47,22.68 25.38,22.68 25.68,22.38 U2.16
A11
  Top 0.152: X1.C8 13.69,27.94 21.26,20.37 U2.20
A12  (via drill 0.33 pad 0.69)
  Top 0.152: U1.17 v28.13,7.9
  Bottom 0.152: X1.B3 11.15,15.24 12.14,14.25 21.78,14.25 v28.13,7.9
A13
  Top 0.152: X1.C5 13.69,20.32 21.73,12.28 25.6,12.28 25.74,12.42 U1.8
A14
  Top 0.152: X1.C4 13.69,17.78 21.06,10.41 U1.12
A15
  Top 0.152: X1.A3 8.61,15.24 9.6,14.25 12.79,14.25 20.61,6.43 24.41,6.43 24.89,6.91 U1.19
A16
  Top 0.152: X1.B2 11.15,12.7 12.14,11.71 13.16,11.71 19.46,5.41 U1.22
A17
  Top 0.152: X1.C3 13.69,15.24 20.61,8.33 25.66,8.33 25.74,8.41 U1.16
A_LV0
  Top 0.152: U2.26 82.37,18.87 85.38,15.86 88,15.86 91.09,18.96 IC2.50
A_LV1
  Top 0.152: U1.47 87.99,15.42 91.49,18.92 91.49,24.66 91.59,24.77 IC2.51
A_LV2
  Top 0.152: U1.44 87.35,13.92 92.16,18.73 92.16,24.1 92.59,24.53 IC2.53
A_LV3
  Top 0.152: U1.43 87.28,13.41 92.47,18.6 92.47,23.23 93.09,23.86 IC2.54
A_LV4
  Top 0.152: IC2.57 94.59,24.31 96.6,22.31 96.6,19.58 88.93,11.91 U1.40
A_LV5
  Top 0.152: IC2.58 95.09,24.24 96.92,22.42 96.92,19.47 88.37,10.92 U1.38
A_LV6
  Top 0.152: IC2.60 96.09,24.11 97.57,22.63 97.57,19.26 88.22,9.91 U1.36
A_LV7
  Top 0.152: IC2.61 96.59,24.04 97.88,22.76 97.88,19.14 88.14,9.4 U1.35
A_LV8
  Top 0.152: U1.46 87.91,14.91 91.86,18.85 91.86,24.22 92.09,24.46 IC2.52
A_LV9
  Top 0.152: IC2.49 90.59,18.89 87.87,16.16 85.76,16.16 82.54,19.38 U2.27
A_LV10
  Top 0.152: IC2.44 88.09,24.38 88.33,24.14 88.33,18.35 87.37,17.39 86.42,17.39 81.42,22.38 U2.33
A_LV11
  Top 0.152: U2.29 81.98,20.37 85.89,16.47 87.75,16.47 90.09,18.82 IC2.48
A_LV12
  Top 0.152: U1.32 35.22,7.9 35.33,8.01 87.63,8.01 99.12,19.5 99.12,24.74 99.09,24.77 IC2.66
A_LV13
  Top 0.152: U1.41 89.01,12.42 96.29,19.71 96.29,22.18 94.09,24.38 IC2.56
A_LV14
  Top 0.152: IC2.59 95.59,24.18 97.22,22.55 97.22,19.34 88.29,10.41 U1.37
A_LV15  (via drill 0.33 pad 0.69)
  Top 0.152: U1.30 35.22,6.91 35.57,6.56 78.92,6.56 v79.17,6.81 | IC2.68 100.09,26.22 98.71,26.22 v98.44,26.5
  Bottom 0.152: v98.44,26.5 79.17,7.23 v79.17,6.81
A_LV16
  Top 0.152: U1.27 85.9,5.41 101.09,20.61 IC2.70
A_LV17
  Top 0.152: IC2.64 98.09,24.77 97.97,24.64 97.97,23.09 98.22,22.85 98.22,19.04 87.58,8.41 U1.33
CLK24MHZ  (via drill 0.33 pad 0.69)
  Top 0.152: v88.2,27.31 86.18,27.31 85.09,26.22 IC2.38 | U5.23 v121.35,44.77
  Bottom 0.152: v88.2,27.31 94.81,33.93 110.51,33.93 v121.35,44.77
D0  (via drill 0.33 pad 0.69)
  Top 0.152: v18.42,29.59 22.31,29.59 25.56,32.84 U3.23
  Bottom 0.152: X1.A8 8.61,27.94 9.93,29.25 18.09,29.25 v18.42,29.59
D1  (via drill 0.33 pad 0.69)
  Top 0.152: v25.14,33.22 25.61,33.22 25.74,33.35 U3.22
  Bottom 0.152: X1.B8 11.15,27.94 12.14,28.93 20.84,28.93 v25.14,33.22
D2
  Top 0.152: X1.A9 8.61,30.48 9.6,31.47 10.02,31.47 11.58,33.03 11.58,33.31 12.5,34.23 25.63,34.23 25.74,34.34 U3.20
D3  (via drill 0.33 pad 0.69)
  Top 0.152: v23.97,34.8 25.69,34.8 25.74,34.85 U3.19
  Bottom 0.152: X1.B9 11.15,30.48 12.16,31.49 15.14,31.49 15.21,31.42 20.59,31.42 v23.97,34.8
D4
  Top 0.152: X1.B10 11.67,34.53 21.75,34.53 23.49,36.27 25.23,36.27 25.67,35.84 U3.17
D5
  Top 0.152: X1.A11 8.61,35.56 9.64,36.59 25.35,36.59 25.59,36.35 U3.16
D6  (via drill 0.33 pad 0.69)
  Top 0.152: v24.71,37.33 25.73,37.33 25.74,37.34 U3.14
  Bottom 0.152: X1.B11 11.15,35.56 12.14,36.55 23.93,36.55 v24.71,37.33
D7  (via drill 0.33 pad 0.69)
  Top 0.152: U3.13 25.74,37.85 25.69,37.9 22.84,37.9 v22.71,37.77
  Bottom 0.152: X1.A12 8.61,38.1 9.61,37.1 22.04,37.1 v22.71,37.77
D8
  Top 0.152: U3.12 22.49,38.35 21.24,37.11 12.14,37.11 11.15,38.1 X1.B12
D9
  Top 0.152: X1.A13 8.61,40.64 10.11,39.14 24.73,39.14 25.45,39.85 U3.9
D10
  Top 0.152: X1.B13 11.15,40.64 12.35,39.45 24.39,39.45 25.3,40.36 U3.8
D11
  Top 0.152: U3.2 25.57,43.36 20.67,48.26 X1.C16
D12
  Top 0.152: X1.C15 22.35,45.72 25.22,42.85 U3.3
D13  (via drill 0.33 pad 0.69)
  Top 0.152: U3.5 v28.12,41.86
  Bottom 0.152: X1.C14 13.69,43.18 13.81,43.3 26.67,43.3 v28.12,41.86
D14
  Top 0.152: X1.C13 13.69,40.64 14.42,41.37 21.86,41.37 21.88,41.35 25.74,41.35 U3.6
D15
  Top 0.152: X1.C12 13.69,38.1 14.31,38.72 25.6,38.72 25.74,38.86 U3.11
D_LV0  (via drill 0.33 pad 0.69)
  Top 0.152: U3.26 35.52,32.84 36.41,31.95 U4.16 53.16,31.95 v53.35,31.77 | IC2.32 80.55,29.45 79.26,28.15 72.35,28.15 v71.65,28.85
  Bottom 0.152: v53.35,31.77 56.27,28.85 v71.65,28.85
D_LV1  (via drill 0.33 pad 0.69)
  Top 0.152: v35.95,33.22 35.35,33.22 35.22,33.35 U3.27 | v58.17,31.95 U4.29 71.34,31.95 75.11,35.72 81.69,35.72 81.92,35.95 IC2.19
  Bottom 0.152: v35.95,33.22 36.8,32.37 57.76,32.37 v58.17,31.95
D_LV2
  Top 0.152: U3.29 35.64,34.34 37.21,32.77 U4.15 53.63,32.77 55.08,31.32 56.63,31.32 61.94,26.02 82.69,26.02 83.68,27.01 83.68,28.64 83.37,28.95 IC2.33
D_LV3  (via drill 0.33 pad 0.69)
  Top 0.152: IC2.17 81.92,36.95 81.03,36.06 74.72,36.06 71.42,32.77 U4.30 62.5,32.77 62.28,32.98 v55.33,32.98 | v36.57,34.65 36.37,34.85 U3.30
  Bottom 0.152: v55.33,32.98 38.24,32.98 v36.57,34.65
D_LV4
  Top 0.152: IC2.34 83.37,28.45 83.37,27.18 82.54,26.35 62.09,26.35 56.8,31.63 55.42,31.63 53.51,33.55 U4.14 51.22,33.55 51.05,33.38 39.08,33.38 36.75,35.71 35.35,35.71 35.22,35.84 U3.32
D_LV5  (via drill 0.33 pad 0.69)
  Top 0.152: v36.9,36.28 35.28,36.28 35.22,36.35 U3.33 | v54.17,34.13 61.91,34.13 62.5,33.55 U4.31 64.35,33.55 64.5,33.4 71.63,33.4 74.62,36.39 80.86,36.39 81.92,37.45 IC2.16
  Bottom 0.152: v54.17,34.13 39.05,34.13 v36.9,36.28
D_LV6
  Top 0.152: U3.35 37.78,37.34 41.39,33.73 50.21,33.73 50.84,34.37 U4.13 53.07,34.37 53.39,34.05 53.44,34.05 55.54,31.95 57.22,31.95 62.5,26.67 78.42,26.67 79.7,27.95 IC2.35
D_LV7  (via drill 0.33 pad 0.69)
  Top 0.152: v48.97,37.75 35.31,37.75 35.22,37.85 U3.36 | IC2.15 81.92,37.95 80.67,36.7 71.99,36.7 69.02,33.73 64.99,33.73 64.35,34.37 U4.32 62.5,34.37 62.04,34.82 v53.44,34.82
  Bottom 0.152: v53.44,34.82 51.9,34.82 v48.97,37.75
D_LV8  (via drill 0.33 pad 0.69)
  Top 0.152: v47.15,44.35 53.38,50.57 86.14,50.57 89.09,47.62 IC2.135 | U4.10 51.22,36.75 49.63,38.34 v46.54,38.34 46.53,38.35 35.22,38.35 U3.37
  Bottom 0.152: v47.15,44.35 46.54,43.73 v46.54,38.34
D_LV9  (via drill 0.33 pad 0.69)
  Top 0.152: v61.22,38.51 54.02,38.51 53.07,37.57 U4.9 51.22,37.57 49.18,39.6 35.47,39.6 35.22,39.85 U3.40 | IC2.136 88.59,46.17 86.87,44.44 v85.97,44.44
  Bottom 0.152: v61.22,38.51 67.15,44.44 v85.97,44.44
D_LV10  (via drill 0.33 pad 0.69)
  Top 0.152: v54.93,37.74 55.1,37.57 U4.36 64.35,37.57 64.5,37.72 76.48,37.72 76.84,37.36 80.33,37.36 81.92,38.95 IC2.13 | U3.41 v48.88,40.36
  Bottom 0.152: v48.88,40.36 52.31,40.36 v54.93,37.74
D_LV11  (via drill 0.33 pad 0.69)
  Top 0.152: v47.16,43.23 35.34,43.23 35.22,43.36 U3.47 | v56.01,41.8 59.86,41.8 62.5,39.17 U4.38 64.35,39.17 64.91,38.61 76.6,38.61 77.24,37.97 79.94,37.97 81.92,39.95 IC2.11
  Bottom 0.152: v56.01,41.8 54.58,43.23 v47.16,43.23
D_LV12
  Top 0.152: 48.45,42.66 48.45,43.76 54.95,50.27 84.95,50.27 87.59,47.62 IC2.138 | 48.45,42.66 35.4,42.66 35.22,42.85 U3.46 | 48.45,42.66 49.2,41.91 49.2,41.28 51.22,39.26 51.22,39.17 U4.7
D_LV13  (via drill 0.33 pad 0.69)
  Top 0.152: v48.55,41.68 35.4,41.68 35.22,41.86 U3.44 | IC2.12 81.92,39.45 80.14,37.67 76.96,37.67 76.32,38.3 64.4,38.3 64.35,38.35 U4.37 62.5,38.35 61.33,39.52 v56.58,39.52
  Bottom 0.152: v56.58,39.52 54.42,41.68 v48.55,41.68
D_LV14  (via drill 0.33 pad 0.69)
  Top 0.152: U3.43 35.22,41.35 35.64,40.93 49.12,40.93 49.45,40.6 49.45,40.12 51.22,38.35 U4.8 53.07,38.35 55.95,41.23 v59.46,41.23 | IC2.137 88.09,46.17 87.35,46.17 v87.08,45.89
  Bottom 0.152: v59.46,41.23 63.77,45.54 86.73,45.54 v87.08,45.89
D_LV15  (via drill 0.33 pad 0.69)
  Top 0.152: v54.93,36.74 54.94,36.75 U4.35 64.72,36.75 65.36,37.39 74.75,37.39 75.14,37 80.47,37 81.92,38.45 IC2.14 | v48.9,38.99 35.35,38.99 35.22,38.86 U3.38
  Bottom 0.152: v48.9,38.99 51.15,36.74 v54.93,36.74
FTDI_D0
  Top 0.152: U5.24 121.89,45.4 121.47,45.83 107.16,45.83 104.77,43.45 IC2.105
FTDI_D1  (via drill 0.33 pad 0.69)
  Top 0.152: v107.02,41.95 IC2.102 | U5.4 v115.11,43.5
  Bottom 0.152: v107.02,41.95 108.57,43.5 v115.11,43.5
FTDI_D2
  Top 0.152: IC2.103 104.77,42.45 107.34,45.02 115.41,45.02 115.65,44.77 U5.2
FTDI_D3
  Top 0.152: IC2.97 115.3,39.45 116.18,40.32 U5.9
FTDI_D4
  Top 0.152: IC2.104 104.77,42.95 107.23,45.4 U5.1
FTDI_D5
  Top 0.152: U5.7 116.16,41.59 115.51,40.95 IC2.100
FTDI_D6
  Top 0.152: U5.8 116.18,40.96 115.17,39.95 IC2.98
FTDI_D7
  Top 0.152: IC2.101 104.77,41.45 104.84,41.37 107.61,41.37 109.35,43.11 114.66,43.11 114.91,42.86 U5.5
FTDI_RD
  Top 0.152: U5.11 104.88,39.05 104.77,38.95 IC2.96
FTDI_RXF
  Top 0.152: U5.21 123.85,43.5 123.85,45.7 123.41,46.14 107.03,46.14 104.84,43.95 IC2.106
FTDI_TXE
  Top 0.152: U5.20 123.85,42.86 124.16,43.17 124.16,45.86 123.57,46.45 106.78,46.45 104.77,44.45 IC2.107
FTDI_WR
  Top 0.152: IC2.95 116.15,38.45 116.18,38.42 U5.12
GND  (via drill 0.33 pad 0.69, 0.6 pad 0.96)
  Top 0.254: IC2.144 84.59,47.67 84.41,47.67 v83.82,48.26 | U2.3 28.89,28.89 | U5.19 121.84,42.23 121.72,42.34 v121.59,42.34 | Q1.2 135.77,25.09 135.93,24.92 v136.02,24.92 | IC2.36 81.86,27.45 81.75,27.33 v81.64,27.33 | C6.2 133.11,42.23 133.17,42.29 v133.57,42.29 | C7.2 133.11,35.88 133.12,35.87 v133.57,35.87 | v136,21.91 Q2.2 | v134.79,17.7 Q3.2 | v32.83,14.4 U1.45 | C8.2 109.22,42.23 v109.22,41.91 | U2.11 28.38,24.89 28.87,25.38 U2.10 23.79,25.38 C4.2 v21.59,25.09 v21.59,25.08 | 29.84,5.08 30.8,5.08 | U1.24 29.18,4.42 29.84,5.08 | U1.1 29.18,15.9 29.84,15.24 29.84,5.08 | U2.13 28.51,23.88 28.89,23.5 v28.89,22.86 28.87,22.89 U2.15 | U2.12 28.51,24.38 28.89,24.77 v28.89,25.4 | U2.9 28.41,25.88 v28.89,25.4 | U2.8 28.54,26.39 28.89,26.04 v28.89,25.4 | U2.6 28.65,27.38 28.89,27.62 v28.89,28.26 | U2.5 28.52,27.89 v28.89,28.26 | 28.89,28.89 v28.89,28.26 | U2.2 28.71,29.39 28.89,29.21 28.89,28.89 | U2.21 28.69,19.89 v28.89,19.68 | U2.4 28.78,28.37 v28.89,28.26 | U1.4 28.78,14.4 v28.89,14.29 | U1.10 28.87,11.4 v28.89,11.43 | U1.21 28.78,5.92 v28.89,6.03 | U3.10 28.55,39.34 v28.57,39.37 | U3.15 28.55,36.85 v28.57,36.83 | U3.21 28.46,33.86 v28.57,33.97 | U3.34 32.41,36.85 v32.38,36.83 | U3.28 32.5,33.86 v32.38,33.97 | 30.8,29.21 v31.43,29.84 34.14,29.84 U2.48 | 29.84,29.21 30.8,29.21 | U2.1 29.18,29.87 29.84,29.21 | 31.43,18.41 31.43,15.93 31.14,15.9 | U2.25 31.77,18.39 31.43,18.41 | U2.28 30.91,19.89 30.8,20 | U2.39 32.41,25.38 v32.38,25.4 | U2.34 32.41,22.89 v32.38,22.86 | U1.39 32.73,11.4 v32.7,11.43 | U1.34 32.73,8.91 v32.7,8.89 | U1.28 31,5.92 30.8,5.71 | 30.8,5.08 31.43,4.45 34.14,4.45 U1.25 | 30.8,5.71 30.8,5.08 | 31.14,15.9 30.8,15.56 30.8,5.71
  Top 0.254: U1.48 31.14,15.9 | U2.45 31,28.37 30.8,28.57 | 30.8,28.57 30.8,29.21 | 30.8,20 30.8,28.57 | 31.43,18.41 30.8,19.05 30.8,20 | U2.24 29.18,18.39 29.84,19.05 29.84,29.21 | U3.39 32.41,39.34 v32.38,39.37 | U3.45 32.5,42.34 v32.38,42.55 | U1.15 24.74,8.91 24.45,9.21 C3.2 v21.59,9.21 | 65.41,35.97 65.95,36.51 C20.2 67.31,36.2 v69.22,36.2 | IC2.72 102.09,27.48 v101.92,27.62 | IC2.18 84.7,36.45 v84.77,36.51 | C14.2 v93.66,18.1 | C13.2 v87,18.1 | IC2.47 89.59,27.56 v89.53,27.62 | IC2.62 97.09,27.56 v97.16,27.62 | C15.2 v111.44,25.4 | IC2.99 102.04,40.45 v101.92,40.32 | IC2.89 102.75,35.45 102.55,35.24 v101.92,35.24 101.92,35.88 101.98,35.95 IC2.90 | C17.2 v105.41,52.38 v105.41,52.39 | IC2.108 101.78,44.95 v101.6,44.77 | IC2.114 99.59,44.98 v99.38,44.77 | IC2.123 95.09,44.92 v95.25,44.77 | C16.2 v111.44,33.02 | C18.2 v93.34,54.29 | IC2.29 80.18,30.95 80.01,31.11 C12.2 v78.42,29.21 | C10.2 v74.61,46.35 | C11.2 v74.61,41.27 | U4.12 48.49,35.15 48.26,34.92 | 48.26,34.92 v46.35,34.92 | C19.2 48.26,34.92 | C9.2 C8.2 | U5.6 C8.2 | v21.59,42.55 21.91,42.23 C5.2 23.61,42.34 U3.4 | 65.41,35.97 65.5,35.97 | U4.34 65.41,35.97
  Top 0.813: IC1.1 32.8,53.98 34.92,53.98 35.24,54.29 C2.2 38.41,54.29 v38.73,54.61 | C1.2 21.91,51.12 v21.59,50.8
  pour Route2: 0,58.42 0,0 151.13,0 151.13,58.42
JTCK  (via drill 0.33 pad 0.69)
  Top 0.152: IC2.67 99.59,24.6 v99.69,24.5
  Bottom 0.152: X3.3 97.79,22.6 v99.69,24.5
JTDI
  Top 0.152: X3.1 102.63,13.1 102.63,27.93 102.22,28.35 99.47,28.35 97.59,26.47 IC2.63
JTDO
  Top 0.152: X3.4 102.94,5.78 102.94,31.78 98.67,36.05 98.67,42.52 95.59,45.59 IC2.122
JTMS  (via drill 0.33 pad 0.69)
  Top 0.152: IC2.65 98.59,24.43 v98.55,24.38
  Bottom 0.152: X3.2 95.25,20.58 98.55,23.88 v98.55,24.38
N$1
  Top 0.152: R3.1 138.55,25.4 137.92,26.04 Q1.3
N$2
  Top 0.152: U5.18 124.95,41.59 125.27,41.91 L1.2
N$3
  Top 0.152: X2.1 129.38,41.26 128.73,41.91 L1.1
N$4
  Top 0.152: U5.14 124.22,39.05 125.17,40.01 R1.2
N$5
  Top 0.152: U5.13 123.85,38.42 124.17,38.1 R2.2
N$6
  Top 0.152: C6.1 132.08,39.89 | 132.08,39.89 128.95,39.89 128.83,40.01 R1.1 | X2.2 133.21,38.76 132.08,39.89
N$7
  Top 0.152: R2.1 130.78,38.1 131.1,37.78 C7.1 137.33,37.78 137.95,38.4 137.95,38.76 X2.3
N$8
  Top 0.152: U5.16 121.89,40.32 118.14,44.08 118.14,44.13 U5.3 114.65,44.13 114.64,44.13 C8.1 C9.1
  Top 0.254: U5.15 121.84,39.69 121.84,40.27 121.89,40.32
N$9
  Top 0.152: R4.1 Q2.3
N$10
  Top 0.152: R5.1 138.55,20.32 137.92,19.68 Q3.3
N$11
  Top 0.152: R3.2 LED1.C
N$12
  Top 0.152: R4.2 LED2.C
N$13
  Top 0.152: R5.2 LED3.C
N$16
  Top 0.152: R6.1 128.35,27.3 125.29,30.36 107.22,30.36 105.63,31.95 IC2.82
N$17
  Top 0.152: R7.1 128.35,24.13 122.46,30.01 106.24,30.01 104.81,31.45 IC2.81
N$18
  Top 0.152: R8.1 128.35,20.95 122.82,26.49 109.23,26.49 104.77,30.95 IC2.80
N$19
  Top 0.152: R6.2 133.54,27.3 133.86,26.98 Q1.1
N$20
  Top 0.152: R7.2 133.54,24.13 133.86,23.81 Q2.1
N$21
  Top 0.152: R8.2 133.54,20.95 133.86,20.64 Q3.1
RAMA0
  Top 0.152: IC2.140 86.59,47.62 84.58,49.64 55.22,49.64 50.28,44.7 50.28,41.7 51.22,40.77 U4.5
RAMA1
  Top 0.152: IC2.142 85.59,47.97 84.27,49.29 55.31,49.29 50.61,44.59 50.61,42.16 51.22,41.55 U4.4
RAMA2
  Top 0.152: IC2.143 85.09,47.99 84.11,48.98 55.43,48.98 50.91,44.47 50.91,42.67 51.22,42.37 U4.3
RAMA3
  Top 0.152: U4.2 51.22,43.16 51.22,44.34 51.66,44.78 80.42,44.78 80.76,44.45 IC2.2
RAMA4
  Top 0.152: U4.1 53.07,43.97 53.56,44.45 80.27,44.45 80.77,43.95 IC2.3
RAMA5
  Top 0.152: U4.44 64.35,43.97 64.87,43.45 IC2.4
RAMA6
  Top 0.152: U4.43 64.35,43.16 64.56,42.95 IC2.5
RAMA7
  Top 0.152: U4.42 64.35,42.37 64.58,42.6 80.49,42.6 80.64,42.45 IC2.6
RAMA8
  Top 0.152: IC2.20 81.92,35.45 81.62,35.15 74.97,35.15 70.17,30.35 U4.27
RAMA9
  Top 0.152: IC2.21 81.92,34.95 81.81,34.84 75.09,34.84 69.82,29.57 U4.26
RAMA10
  Top 0.152: U4.25 69.44,28.75 75.13,34.45 IC2.22
RAMA11
  Top 0.152: U4.24 69.51,27.96 75.49,33.95 IC2.23
RAMA12  (via drill 0.33 pad 0.69)
  Top 0.152: v81.38,32.87 81.84,32.87 81.92,32.95 IC2.25 | U4.22 v58.53,27.15
  Bottom 0.152: v58.53,27.15 75.27,27.15 79.35,31.23 80.02,31.23 81.38,32.59 v81.38,32.87
RAMA13
  Top 0.152: IC2.26 83.37,32.45 84.59,31.23 84.59,26.63 83.06,25.1 61.41,25.1 58.54,27.96 U4.21
RAMA14  (via drill 0.33 pad 0.69)
  Top 0.152: U4.20 53.07,28.75 53.08,28.75 v53.5,28.75 | IC2.27 v79.9,31.95
  Bottom 0.152: v53.5,28.75 53.97,28.28 72.88,28.28 76.55,31.95 v79.9,31.95
RAMA15
  Top 0.152: IC2.28 83.37,31.45 84.29,30.53 84.29,26.76 82.94,25.41 61.53,25.41 57.41,29.53 53.11,29.53 53.07,29.57 U4.19
RAMA16  (via drill 0.33 pad 0.69)
  Top 0.152: U4.18 53.07,30.35 53.32,30.11 v56.58,30.11 | v72.61,28.86 73.01,28.46 78.73,28.46 80.71,30.45 IC2.30
  Bottom 0.152: v72.61,28.86 71.36,30.11 v56.58,30.11
RAMA17
  Top 0.152: U4.23 69.13,27.15 75.42,33.45 IC2.24
TGT_DIR
  Top 0.152: U3.1 27.85,43.84 29.29,42.41 29.29,33.66 | IC2.41 86.59,24.77 85.63,23.8 42.53,23.8 35.22,31.11 31.83,31.11 29.29,33.66 | U3.24 27.98,32.36 29.29,33.66

### Text on the board
tNames: DATATRAK LOCATOR Mk.II / ROM CARTRIDGE EMULATOR / REV B 2016-11-16 PAP